# EAGLE design Tractive System Board Rev1 (EAGLE 9.6.2)

## Sheet 1 of 3
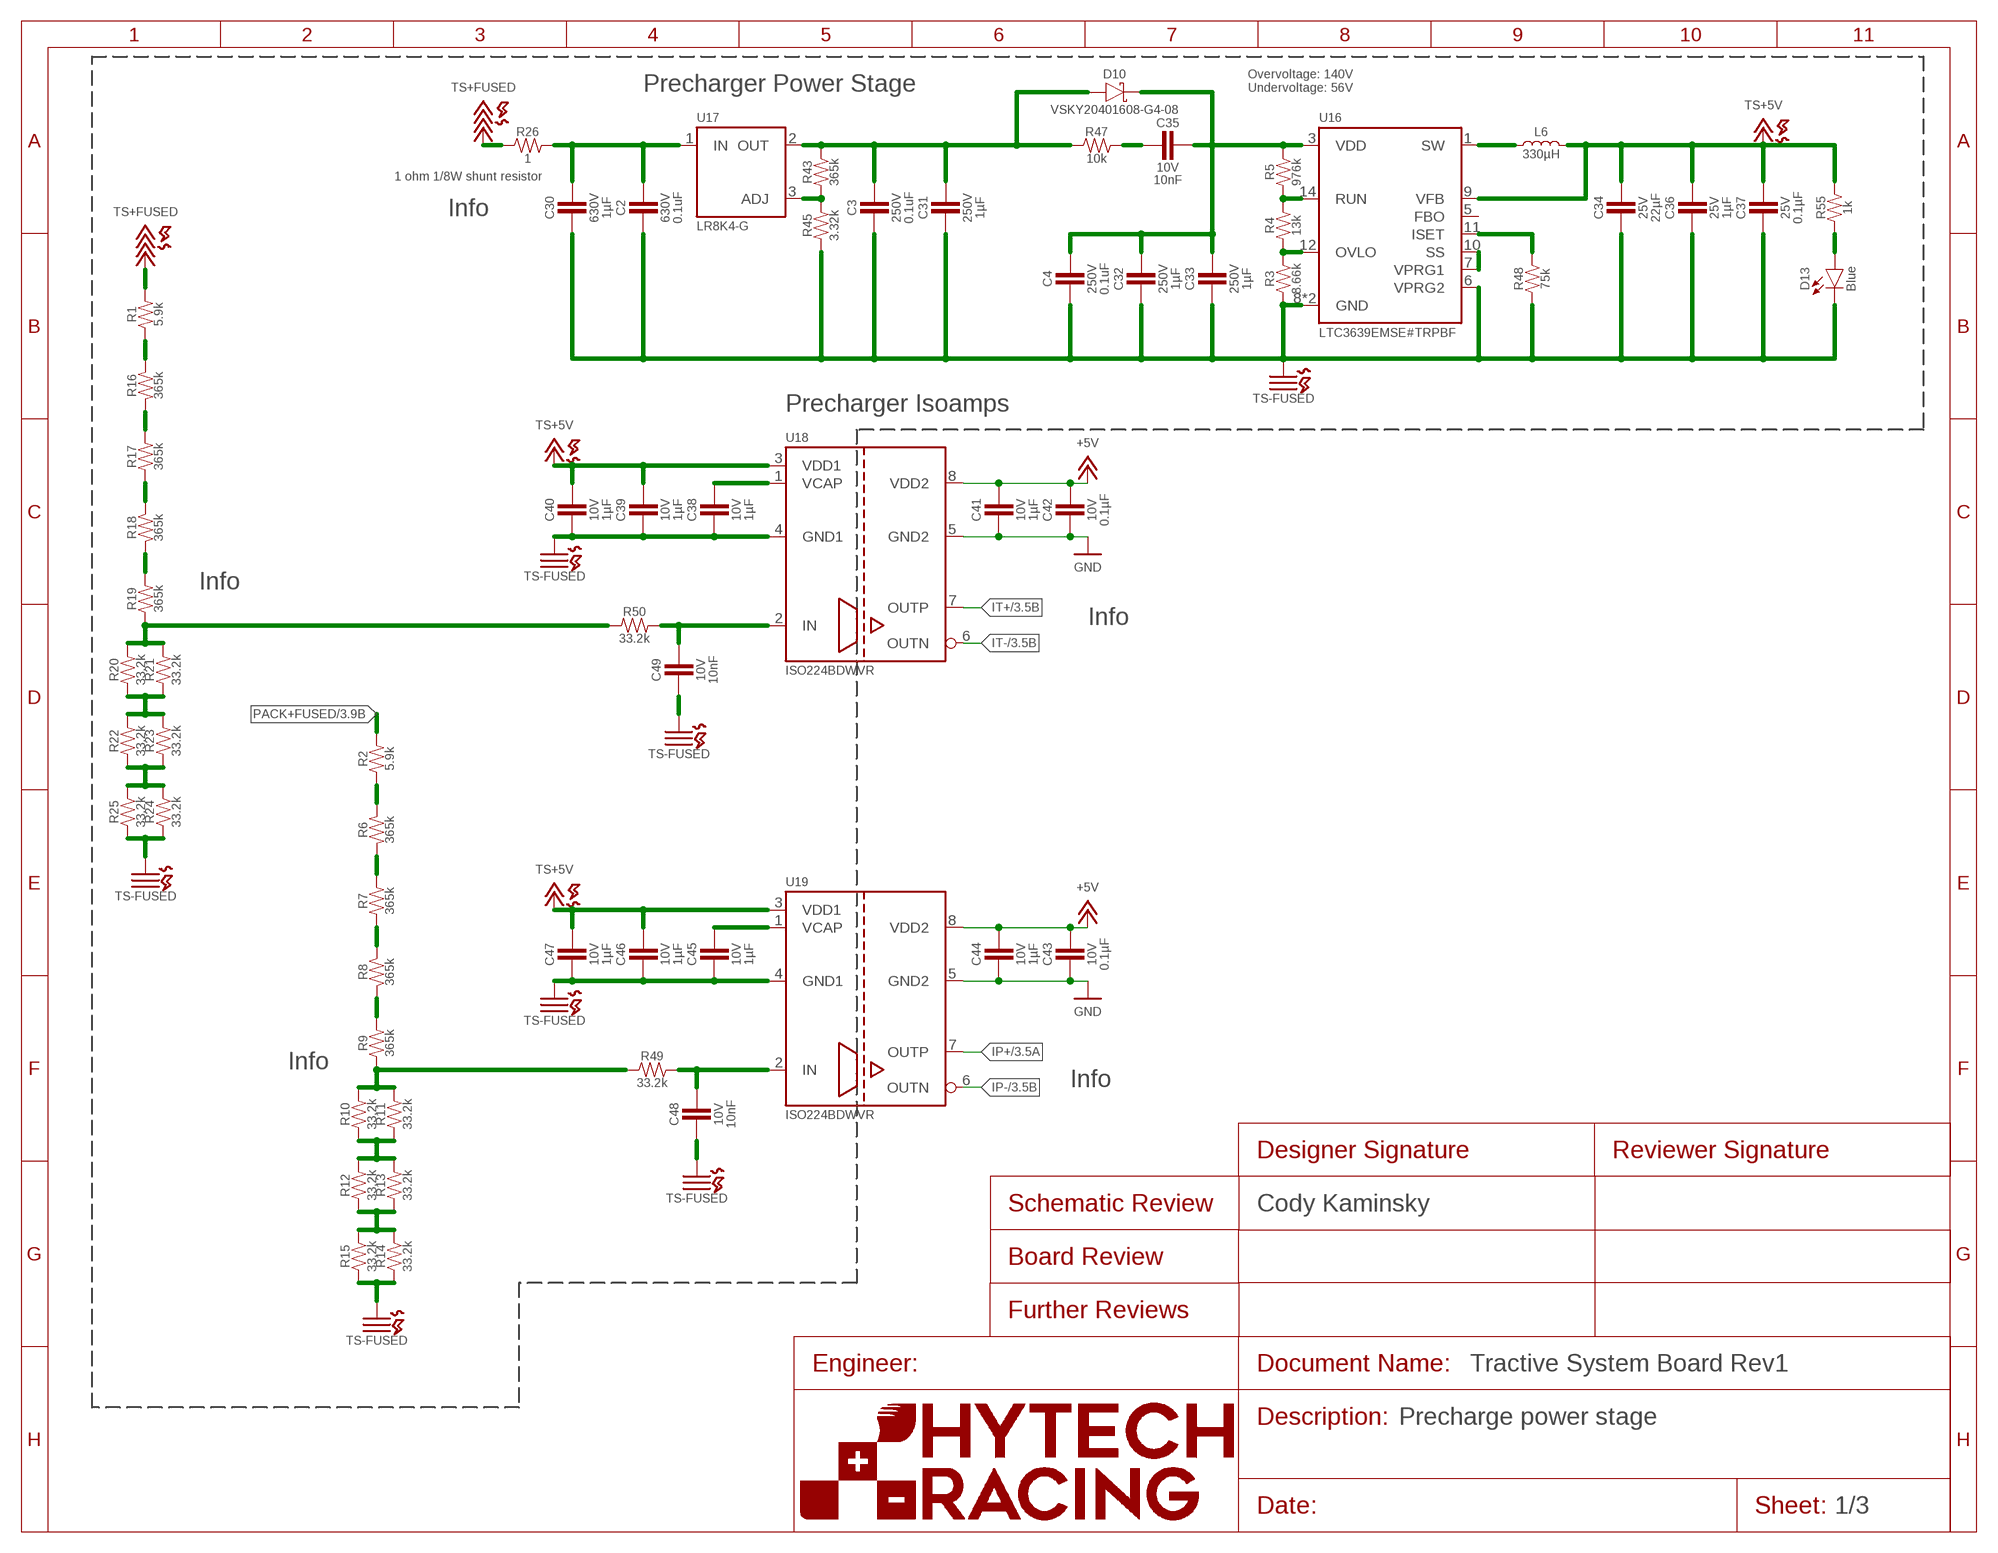
[diagram p0: schematic, sheet 1]
FRAME5 (FRAME): DESCRIPTION_1: Precharge power stage; DESIGNER_SCHEMATIC: Cody Kaminsky

### Parts
C2  CAPACITOR_2220_630V_0.1UF  [2220-CAP]
C3  CAPACITOR_1206_250V_0.1UF  [1206-CAP]
C4  CAPACITOR_1206_250V_0.1UF  [1206-CAP]
C30  CAPACITOR_2220_630V_1UF  [2220-CAP]
C31  CAPACITOR_2220_250V_1UF  [2220-CAP]
C32  CAPACITOR_2220_250V_1UF  [2220-CAP]
C33  CAPACITOR_2220_250V_1UF  [2220-CAP]
C34  CAPACITOR_0805_25V_22UF  [0805-CAP]
C35  CAPACITOR_0603_10V_10NF  [0603-CAP]
C36  CAPACITOR_0603_25V_1UF  [0603-CAP]
C37  CAPACITOR_0603_25V_0.1UF  [0603-CAP]
C38  CAPACITOR_0603_10V_1UF  [0603-CAP]
C39  CAPACITOR_0603_10V_1UF  [0603-CAP]
C40  CAPACITOR_0603_10V_1UF  [0603-CAP]
C41  CAPACITOR_0603_10V_1UF  [0603-CAP]
C42  CAPACITOR_0603_10V_0.1UF  [0603-CAP]
C43  CAPACITOR_0603_10V_0.1UF  [0603-CAP]
C44  CAPACITOR_0603_10V_1UF  [0603-CAP]
C45  CAPACITOR_0603_10V_1UF  [0603-CAP]
C46  CAPACITOR_0603_10V_1UF  [0603-CAP]
C47  CAPACITOR_0603_10V_1UF  [0603-CAP]
C48  CAPACITOR_0603_10V_10NF  [0603-CAP]
C49  CAPACITOR_0603_10V_10NF  [0603-CAP]
D10  SCHOTTKY  [CLP1608-2L]
D13  LED_0603_BLUE  [0603-LED]
L6  INDUCTOR_SRU1048_330UH  [SRU1048]
R1  RESISTOR_0603_5.9K  [0603-RES]
R2  RESISTOR_0603_5.9K  [0603-RES]
R3  RESISTOR_0603_8.66K  [0603-RES]
R4  RESISTOR_0603_13K  [0603-RES]
R5  RESISTOR_0805_976K  [0805-RES]
R6  RESISTOR_0805_365K  [0805-RES]
R7  RESISTOR_0805_365K  [0805-RES]
R8  RESISTOR_0805_365K  [0805-RES]
R9  RESISTOR_0805_365K  [0805-RES]
R10  RESISTOR_0603_33.2K  [0603-RES]
R11  RESISTOR_0603_33.2K  [0603-RES]
R12  RESISTOR_0603_33.2K  [0603-RES]
R13  RESISTOR_0603_33.2K  [0603-RES]
R14  RESISTOR_0603_33.2K  [0603-RES]
R15  RESISTOR_0603_33.2K  [0603-RES]
R16  RESISTOR_0805_365K  [0805-RES]
R17  RESISTOR_0805_365K  [0805-RES]
R18  RESISTOR_0805_365K  [0805-RES]
R19  RESISTOR_0805_365K  [0805-RES]
R20  RESISTOR_0603_33.2K  [0603-RES]
R21  RESISTOR_0603_33.2K  [0603-RES]
R22  RESISTOR_0603_33.2K  [0603-RES]
R23  RESISTOR_0603_33.2K  [0603-RES]
R24  RESISTOR_0603_33.2K  [0603-RES]
R25  RESISTOR_0603_33.2K  [0603-RES]
R26  RESISTOR_0805_1  [0805-RES]
R43  RESISTOR_0805_365K  [0805-RES]
R45  RESISTOR_0603_3.32K  [0603-RES]
R47  RESISTOR_0603_10K  [0603-RES]
R48  RESISTOR_0603_75K  [0603-RES]
R49  RESISTOR_0603_33.2K  [0603-RES]
R50  RESISTOR_0603_33.2K  [0603-RES]
R55  RESISTOR_0603_1K  [0603-RES]
U16  LTC3639  [MSE16(12)]
U17  VOLTAGE_REGULATOR_ADJ_LR8_DPAK  [DPAK(2-7K1S)]
U18  ISO224B_AIRGAP  [SOIC-08(WIDE,0.295")-AIRGAP]
U19  ISO224B_AIRGAP  [SOIC-08(WIDE,0.295")-AIRGAP]

### Nets
+5V: C41.1 C42.1 C43.1 C44.1 U18.8(VDD2) U19.8(VDD2) ; also sheet 2,3
GND: C41.2 C42.2 C43.2 C44.2 U18.5(GND2) U19.5(GND2) ; also sheet 2,3
IP+: U19.7(OUTP) ; also sheet 3
IP-: U19.6(OUTN) ; also sheet 3
IT+: U18.7(OUTP) ; also sheet 3
IT-: U18.6(OUTN) ; also sheet 3
N$2: R3.2 R4.1 U16.12(OVLO)
N$5: R4.2 R5.1 U16.14(RUN)
N$7: R6.2 R7.2
N$8: R7.1 R8.1
N$9: R1.1 R16.1
N$10: R2.1 R6.1
N$11: R8.2 R9.2
N$12: R20.1 R21.1 R22.2 R23.2
N$13: R9.1 R10.2 R11.2 R49.1
N$15: C2.1 C30.1 R26.2 U17.1(IN)
N$19: R16.2 R17.2
N$20: R17.1 R18.1
N$21: R18.2 R19.2
N$23: R19.1 R20.2 R21.2 R50.1
N$32: R12.1 R13.1 R14.2 R15.2
N$33: R22.1 R23.1 R24.2 R25.2
N$34: R10.1 R11.1 R12.2 R13.2
N$35: D13.2(A) R55.1
N$54: R43.1 R45.2 U17.3(ADJ)
N$58: C3.1 C31.1 D10.2(A) R43.2 R47.1 U17.2(OUT)
N$60: C35.2 R47.2
N$61: C4.1 C32.1 C33.1 C35.1 D10.1(C) R5.2 U16.3(VDD)
N$62: C48.1 R49.2 U19.2(IN)
N$63: C49.1 R50.2 U18.2(IN)
N$64: R48.2 U16.11(ISET)
N$65: L6.1 U16.1(SW)
N$69: C45.1 U19.1(VCAP)
N$73: C38.1 U18.1(VCAP)
N$76: U16.7(VPRG1) U16.10(SS)
PACK+FUSED: R2.2 ; also sheet 3
TS+5V: C34.1 C36.1 C37.1 C39.1 C40.1 C46.1 C47.1 L6.2 R55.2 U16.9(VFB) U18.3(VDD1) U19.3(VDD1) ; also sheet 3
TS+FUSED: R1.2 R26.1 ; also sheet 2,3
TS-FUSED: C2.2 C3.2 C4.2 C30.2 C31.2 C32.2 C33.2 C34.2 C36.2 C37.2 C38.2 C39.2 C40.2 C45.2 C46.2 C47.2 C48.2 C49.2 D13.1(C) R3.1 R14.1 R15.1 R24.1 R25.1 R45.1 R48.1 U16.6(VPRG2) U16.8(GND) U16.16(GND) U18.4(GND1) U19.4(GND1) ; also sheet 2,3
Unconnected: U16.5(FBO)

### Notes on the sheet
- Precharger Power Stage
- Overvoltage: 140V
  Undervoltage: 56V
- 1 ohm 1/8W shunt resistor
- Info
- Precharger Isoamps
- Info
- Info
- Info
- Info

## Sheet 2 of 3
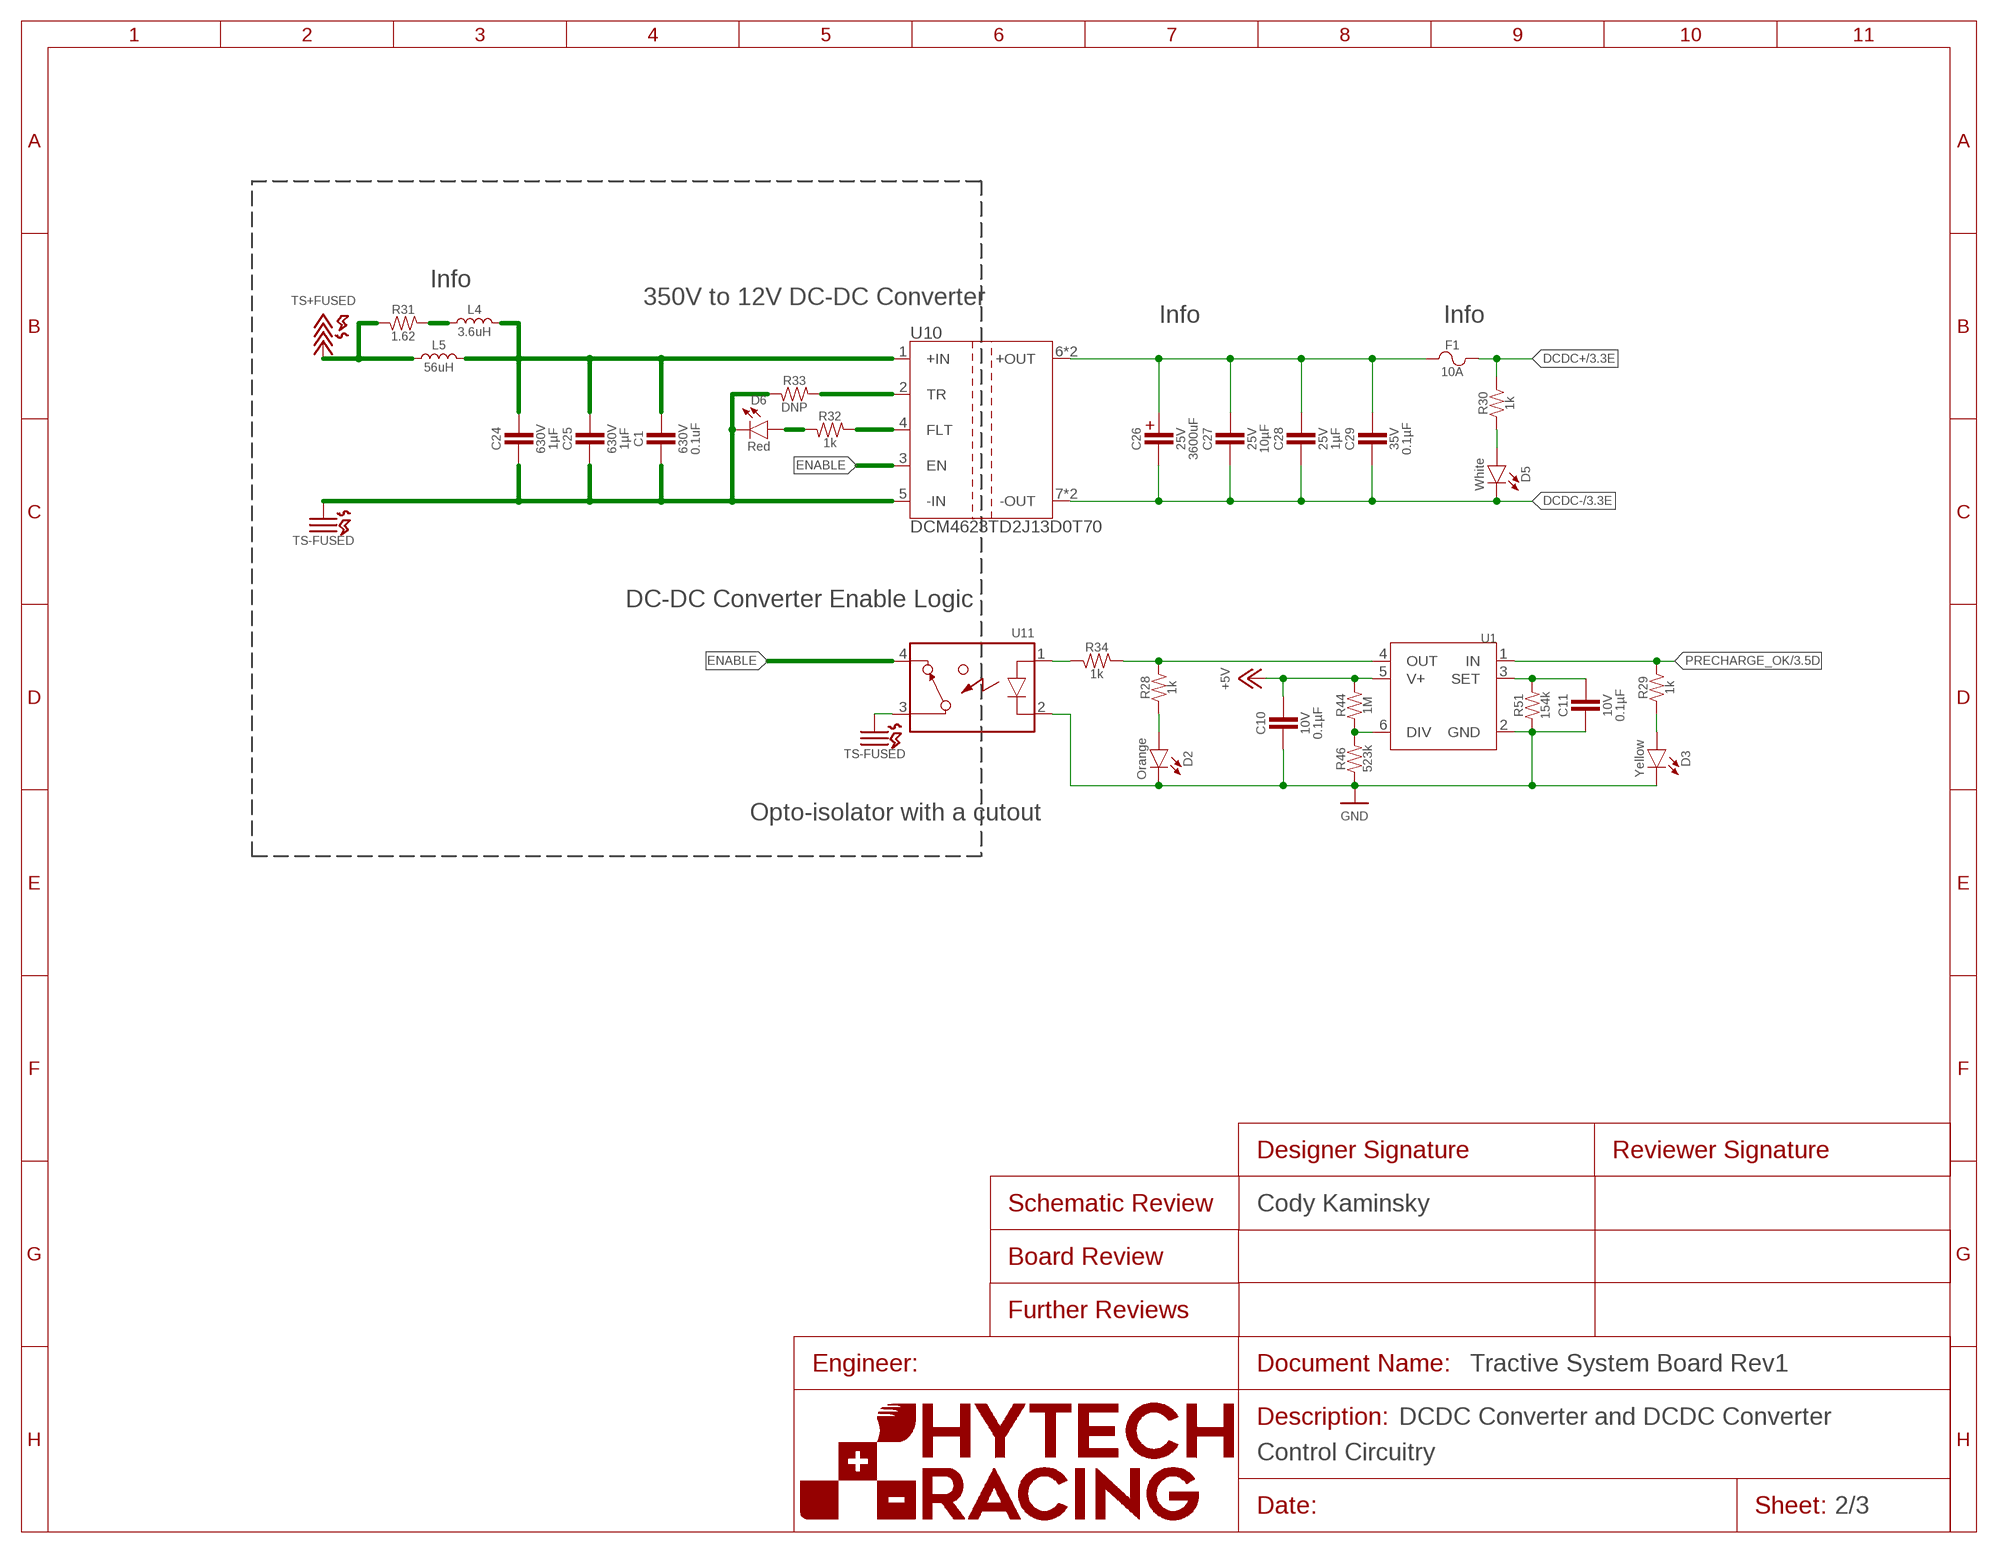
[diagram p1: schematic, sheet 2]
FRAME3 (FRAME): DESCRIPTION_1: DCDC Converter and DCDC Converter; DESCRIPTION_2: Control Circuitry; DESIGNER_SCHEMATIC: Cody Kaminsky

### Parts
C1  CAPACITOR_2220_630V_0.1UF  [2220-CAP]
C10  CAPACITOR_0603_10V_0.1UF  [0603-CAP]
C11  CAPACITOR_0603_10V_0.1UF  [0603-CAP]
C24  CAPACITOR_2220_630V_1UF  [2220-CAP]
C25  CAPACITOR_2220_630V_1UF  [2220-CAP]
C26  CAPACITOR_POLAR__3600UF  [EKYC*MM]
C27  CAPACITOR_0603_25V_10UF  [0603-CAP]
C28  CAPACITOR_0603_25V_1UF  [0603-CAP]
C29  CAPACITOR_0603_35V_0.1UF  [0603-CAP]
D2  LED_0603_ORANGE  [0603-LED]
D3  LED_0603_YELLOW  [0603-LED]
D5  LED_0603_WHITE  [0603-LED]
D6  LED_0603_RED  [0603-LED]
F1  FUSE_MB_10  [MINI-BLADE_FUSE_HOLDER]
L4  INDUCTOR_PA4334_3.6UH  [PA4334]
L5  INDUCTOR_WELMHI_56UH  [WE-LMHI]
R28  RESISTOR_0603_1K  [0603-RES]
R29  RESISTOR_0603_1K  [0603-RES]
R30  RESISTOR_0603_1K  [0603-RES]
R31  RESISTOR_0603_1.62  [0603-RES]
R32  RESISTOR_0603_1K  [0603-RES]
R33  RESISTOR_0603_DNP  [0603-RES]
R34  RESISTOR_0603_1K  [0603-RES]
R44  RESISTOR_0805_1M  [0805-RES]
R46  RESISTOR_0805_523K  [0805-RES]
R51  RESISTOR_0603_154K  [0603-RES]
U1  LTC6994_1  [SOT-23-6]
U10  DCM4623TD2J13D0T70  [DCM4623]
U11  RELAY_SOLIDSTATE_NC_AG  [DIP-4_AIRGAP]

### Nets
+5V: C10.1 R44.2 U1.5(V+) ; also sheet 1,3
DCDC+: F1.L1 F1.L2 R30.2 ; also sheet 3
DCDC-: C26.-(MINUS) C27.1 C28.1 C29.1 D5.1(C) U10.7(-OUT) U10.9(-OUT) ; also sheet 3
ENABLE: U10.3(EN) U11.4(CONTACT2)
GND: C10.2 C11.2 D2.1(C) D3.1(C) R46.1 R51.1 U1.2(GND) U11.2(CONTROL-) ; also sheet 1,3
N$4: R44.1 R46.2 U1.6(DIV)
N$6: R34.2 U11.1(CONTROL+)
N$14: C11.1 R51.2 U1.3(SET)
N$16: R28.2 R34.1 U1.4(OUT)
N$17: D2.2(A) R28.1
N$18: D5.2(A) R30.1
N$22: D3.2(A) R29.1
N$29: L4.2 R31.1
N$39: C1.1 C24.1 C25.1 L4.1 L5.1 U10.1(+IN)
N$43: D6.2(A) R32.2
N$44: R32.1 U10.4(FLT)
N$45: R33.1 U10.2(TR)
N$46: C26.+(PLUS) C27.2 C28.2 C29.2 F1.R1 F1.R2 U10.6(+OUT) U10.8(+OUT)
PRECHARGE_OK: R29.2 U1.1(IN) ; also sheet 3
TS+FUSED: L5.2 R31.2 ; also sheet 1,3
TS-FUSED: C1.2 C24.2 C25.2 D6.1(C) R33.2 U10.5(-IN) U11.3(CONTACT1) ; also sheet 1,3

### Notes on the sheet
- Info
- 350V to 12V DC-DC Converter
- Info | Info
- DC-DC Converter Enable Logic
- Opto-isolator with a cutout

## Sheet 3 of 3
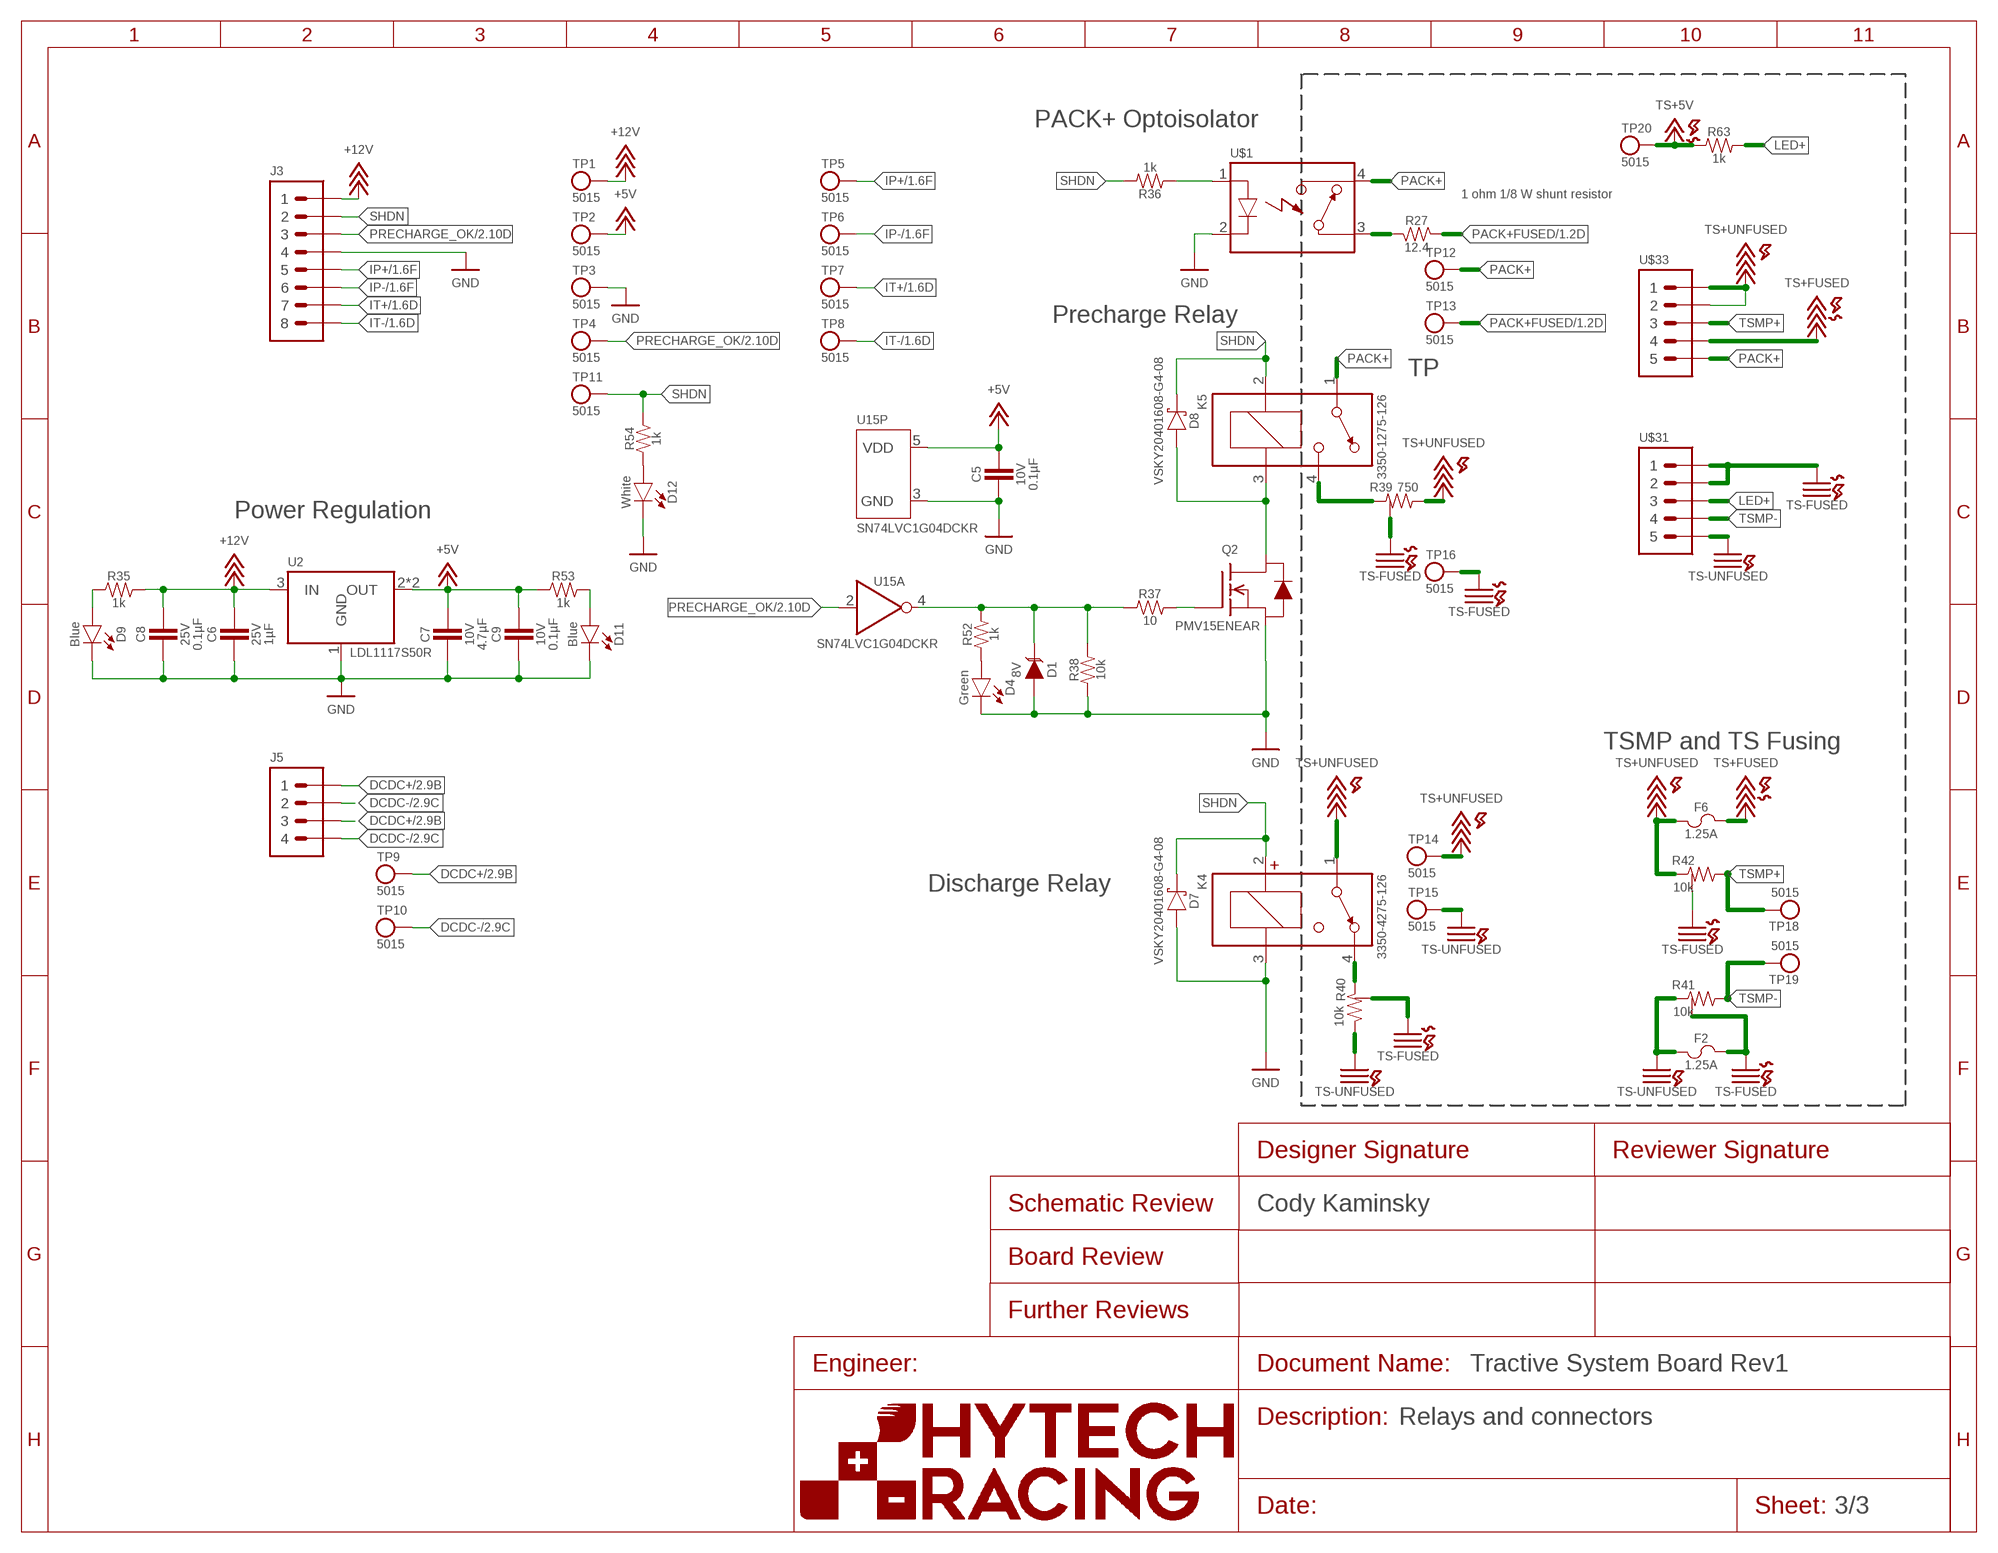
[diagram p2: schematic, sheet 3]
FRAME4 (FRAME): DESCRIPTION_1: Relays and connectors; DESIGNER_SCHEMATIC: Cody Kaminsky

### Parts
C5  CAPACITOR_0603_10V_0.1UF  [0603-CAP]
C6  CAPACITOR_0603_25V_1UF  [0603-CAP]
C7  CAPACITOR_0603_10V_4.7UF  [0603-CAP]
C8  CAPACITOR_0603_25V_0.1UF  [0603-CAP]
C9  CAPACITOR_0603_10V_0.1UF  [0603-CAP]
D1  TVS_8V  [SOT-23]
D4  LED_0603_GREEN  [0603-LED]
D7  SCHOTTKY  [CLP1608-2L]
D8  SCHOTTKY  [CLP1608-2L]
D9  LED_0603_BLUE  [0603-LED]
D11  LED_0603_BLUE  [0603-LED]
D12  LED_0603_WHITE  [0603-LED]
F2  FUSE_0885_1.25  [0885]
F6  FUSE_0885_1.25  [0885]
J3  CONNECTOR-8_MF_T_V_  [MOLEX_MICROFIT_PTH_VERTICAL_08_DUAL]
J5  CONNECTOR-4__  [MOLEX_MICROFIT_PTH_VERTICAL_04_DUAL]
K4  RELAY_SPST_NC_POLARIZED_3550_12  [335X]
K5  RELAY_SPST_NO_3550_12  [335X]
Q2  TRANSISTOR_N_MOS__PMV15ENEA  [SOT-23]
R27  RESISTOR_0805_12.4  [0805-RES]
R35  RESISTOR_0603_1K  [0603-RES]
R36  RESISTOR_0603_1K  [0603-RES]
R37  RESISTOR_0603_10  [0603-RES]
R38  RESISTOR_0603_10K  [0603-RES]
R39  RESISTOR_GND_750  [B20]
R40  RESISTOR_GND_10K  [B20]
R41  RESISTOR_GND_10K  [B20]
R42  RESISTOR_GND_10K  [B20]
R52  RESISTOR_0603_1K  [0603-RES]
R53  RESISTOR_0603_1K  [0603-RES]
R54  RESISTOR_0603_1K  [0603-RES]
R63  RESISTOR_0603_1K  [0603-RES]
TP1  TEST_POINT  [MICRO_MINIATURE]
TP2  TEST_POINT  [MICRO_MINIATURE]
TP3  TEST_POINT  [MICRO_MINIATURE]
TP4  TEST_POINT  [MICRO_MINIATURE]
TP5  TEST_POINT  [MICRO_MINIATURE]
TP6  TEST_POINT  [MICRO_MINIATURE]
TP7  TEST_POINT  [MICRO_MINIATURE]
TP8  TEST_POINT  [MICRO_MINIATURE]
TP9  TEST_POINT  [MICRO_MINIATURE]
TP10  TEST_POINT  [MICRO_MINIATURE]
TP11  TEST_POINT  [MICRO_MINIATURE]
TP12  TEST_POINT  [MICRO_MINIATURE]
TP13  TEST_POINT  [MICRO_MINIATURE]
TP14  TEST_POINT  [MICRO_MINIATURE]
TP15  TEST_POINT  [MICRO_MINIATURE]
TP16  TEST_POINT  [MICRO_MINIATURE]
TP18  TEST_POINT  [MICRO_MINIATURE]
TP19  TEST_POINT  [MICRO_MINIATURE]
TP20  TEST_POINT  [MICRO_MINIATURE]
U2  VOLTAGE_REGULATOR_SOT223_5V  [SOT223]
U15  LOGICGATE_INVERTER_DCKR  [SC-70-5]
U$1  RELAY_SOLIDSTATE_NO_AG  [DIP-4_AIRGAP]
U$31  CONNECTOR-5_MICRO_V6S_  [MOLEX_MICROFIT_PTH_VERTICAL_06_SINGLE_SPACED]
U$33  CONNECTOR-5_MICRO_V7S_  [MOLEX_MICROFIT_PTH_VERTICAL_07_SINGLE_SPACED]

### Nets
+5V: C5.1 C7.1 C9.1 R53.1 TP2.1 U2.2(OUT) U2.4(OUT) U15.5(P:VDD) ; also sheet 1,2
+12V: C6.1 C8.1 J3.1 R35.2 TP1.1 U2.3(IN)
DCDC+: J5.1 J5.3 TP9.1 ; also sheet 2
DCDC-: J5.2 J5.4 TP10.1 ; also sheet 2
GND: C5.2 C6.2 C7.2 C8.2 C9.2 D1.1(A) D4.1(C) D7.2(A) D9.1(C) D11.1(C) D12.1(C) J3.4 K4.3(COIL-) Q2.2(S) R38.1 TP3.1 U2.1(GND) U15.3(P:GND) U$1.2(CONTROL-) ; also sheet 1,2
IP+: J3.5 TP5.1 ; also sheet 1
IP-: J3.6 TP6.1 ; also sheet 1
IT+: J3.7 TP7.1 ; also sheet 1
IT-: J3.8 TP8.1 ; also sheet 1
LED+: R63.2 U$31.3
N$3: Q2.1(G) R37.2
N$24: D4.2(A) R52.1
N$25: D9.2(A) R35.1
N$30: D11.2(A) R53.2
N$31: D12.2(A) R54.1
N$40: D8.2(A) K5.3(COIL-) Q2.3(D)
N$50: K5.4(CONTACT2) R39.1
N$51: K4.4(CONTACT2) R40.1
N$52: D1.3(C) R37.1 R38.2 R52.2 U15.4(A:!IN)
N$53: R36.1 U$1.1(CONTROL+)
N$57: R27.2 U$1.3(CONTACT1)
PACK+: K5.1(CONTACT1) TP12.1 U$1.4(CONTACT2) U$33.5
PACK+FUSED: R27.1 TP13.1 ; also sheet 1
PRECHARGE_OK: J3.3 TP4.1 U15.2(A:IN) ; also sheet 2
SHDN: D7.1(C) D8.1(C) J3.2 K4.2(COIL+) K5.2(COIL+) R36.2 R54.2 TP11.1
TS+5V: R63.1 TP20.1 ; also sheet 1
TS+FUSED: F6.2 U$33.4 ; also sheet 1,2
TS+UNFUSED: F6.1 K4.1(CONTACT1) R39.2 R42.1 TP14.1 U$33.1 U$33.2
TS-FUSED: F2.2 R39.3 R39.4 R39.5 R39.6 R40.3 R40.4 R40.5 R40.6 R41.3 R41.4 R41.5 R41.6 R42.3 R42.4 R42.5 R42.6 TP16.1 U$31.1 U$31.2 ; also sheet 1,2
TS-UNFUSED: F2.1 R40.2 R41.1 TP15.1 U$31.5
TSMP+: R42.2 TP18.1 U$33.3
TSMP-: R41.2 TP19.1 U$31.4

### Notes on the sheet
- PACK+ Optoisolator
- 1 ohm 1/8 W shunt resistor
- Precharge Relay
- TP
- Power Regulation
- TSMP and TS Fusing
- Discharge Relay

## Library data of the parts
C1 C2 = HyTechDevices:CAPACITOR_?_*: Capacitor, Non-Polarized VJ...1BC Series Datasheet <https://www.mouser.com/datasheet/2/427/vjw1bcbascomseries-1762447.pdf> Samsung Datasheet <https://www.mouser.com/datasheet/2/585/MLCC-1837944.pdf> Walsin Datasheet <https://www.mouser.com/datasheet/2/210/WTC_MLCC_General_Purpose-1534899.pdf> GRM188R61A226ME15D <https://www.mouser.com/datasheet/2/281/1/GRM188R61A226ME15_02A-1985787.pdf> GRM188R61E106MA73D <https://www.mouser.com/datasheet/2/281/1/GRM188R61E106MA73_01A-1985806.pdf> 885012006013 <https://www.mouser.com/datasheet/2/445/885012006013-1726946.pdf> 2220Y6300105KXTWS2 <https://www.mouser.com/datasheet/2/218/SMD_High_and_Std_StackiCap_P62-1825512.pdf> Yageo Class 2, X5R <https://www.mouser.com/datasheet/2/447/UPY_GPHC_X5R_4V_to_50V_26-1827097.pdf> TDK C Series <https://www.mouser.com/ProductDetail/TDK/C3216X5R1V226M160AC?qs=%2Fha2pyFadujbcx9jh7lYl%2F4NeMoXFhdc8AqVWNq4wW6M2y7zl6GzBuhgtI0ngznN> AVX Automotive MLCC <https://www.mouser.com/datasheet/2/40/AutoMLCC-777028.pdf> KEMET X7R Series <https://www.mouser.com/datasheet/2/212/KEM_C1002_X7R_SMD-1102033.pdf>; CAPACITANCE: 0.1uF; DKPN: 445-11980-2-ND; MANUFACTURER: TDK Coporation; MOPN: 810-C5750CH2J104K2KC; MPN: C5750CH2J104K280KC; TOLERANCE: 10%; VOLTAGE: 630V
C3 C4 = HyTechDevices:CAPACITOR_?_*: Capacitor, Non-Polarized VJ...1BC Series Datasheet <https://www.mouser.com/datasheet/2/427/vjw1bcbascomseries-1762447.pdf> Samsung Datasheet <https://www.mouser.com/datasheet/2/585/MLCC-1837944.pdf> Walsin Datasheet <https://www.mouser.com/datasheet/2/210/WTC_MLCC_General_Purpose-1534899.pdf> GRM188R61A226ME15D <https://www.mouser.com/datasheet/2/281/1/GRM188R61A226ME15_02A-1985787.pdf> GRM188R61E106MA73D <https://www.mouser.com/datasheet/2/281/1/GRM188R61E106MA73_01A-1985806.pdf> 885012006013 <https://www.mouser.com/datasheet/2/445/885012006013-1726946.pdf> 2220Y6300105KXTWS2 <https://www.mouser.com/datasheet/2/218/SMD_High_and_Std_StackiCap_P62-1825512.pdf> Yageo Class 2, X5R <https://www.mouser.com/datasheet/2/447/UPY_GPHC_X5R_4V_to_50V_26-1827097.pdf> TDK C Series <https://www.mouser.com/ProductDetail/TDK/C3216X5R1V226M160AC?qs=%2Fha2pyFadujbcx9jh7lYl%2F4NeMoXFhdc8AqVWNq4wW6M2y7zl6GzBuhgtI0ngznN> AVX Automotive MLCC <https://www.mouser.com/datasheet/2/40/AutoMLCC-777028.pdf> KEMET X7R Series <https://www.mouser.com/datasheet/2/212/KEM_C1002_X7R_SMD-1102033.pdf>; CAPACITANCE: 0.1uF; DKPN: 445-6079-2-ND; MANUFACTURER: TDK Corporation; MOPN: 810-C3216X7R2E104KT5; MPN: C3216X7R2E104K160AM; TOLERANCE: 10%; VOLTAGE: 250V
C5 C9-C11 C42 C43 = HyTechDevices:CAPACITOR_?_*: Capacitor, Non-Polarized VJ...1BC Series Datasheet <https://www.mouser.com/datasheet/2/427/vjw1bcbascomseries-1762447.pdf> Samsung Datasheet <https://www.mouser.com/datasheet/2/585/MLCC-1837944.pdf> Walsin Datasheet <https://www.mouser.com/datasheet/2/210/WTC_MLCC_General_Purpose-1534899.pdf> GRM188R61A226ME15D <https://www.mouser.com/datasheet/2/281/1/GRM188R61A226ME15_02A-1985787.pdf> GRM188R61E106MA73D <https://www.mouser.com/datasheet/2/281/1/GRM188R61E106MA73_01A-1985806.pdf> 885012006013 <https://www.mouser.com/datasheet/2/445/885012006013-1726946.pdf> 2220Y6300105KXTWS2 <https://www.mouser.com/datasheet/2/218/SMD_High_and_Std_StackiCap_P62-1825512.pdf> Yageo Class 2, X5R <https://www.mouser.com/datasheet/2/447/UPY_GPHC_X5R_4V_to_50V_26-1827097.pdf> TDK C Series <https://www.mouser.com/ProductDetail/TDK/C3216X5R1V226M160AC?qs=%2Fha2pyFadujbcx9jh7lYl%2F4NeMoXFhdc8AqVWNq4wW6M2y7zl6GzBuhgtI0ngznN> AVX Automotive MLCC <https://www.mouser.com/datasheet/2/40/AutoMLCC-777028.pdf> KEMET X7R Series <https://www.mouser.com/datasheet/2/212/KEM_C1002_X7R_SMD-1102033.pdf>; CAPACITANCE: 0.1µF; DKPN: 720-1688-1-ND; MANUFACTURER: Vishay Vitramon; MOPN: 77-VJ0603Y104JXQPBC; MPN: VJ0603Y104JXQPW1BC; TOLERANCE: 5%; VOLTAGE: 10V
C6 C28 C36 = HyTechDevices:CAPACITOR_?_*: Capacitor, Non-Polarized VJ...1BC Series Datasheet <https://www.mouser.com/datasheet/2/427/vjw1bcbascomseries-1762447.pdf> Samsung Datasheet <https://www.mouser.com/datasheet/2/585/MLCC-1837944.pdf> Walsin Datasheet <https://www.mouser.com/datasheet/2/210/WTC_MLCC_General_Purpose-1534899.pdf> GRM188R61A226ME15D <https://www.mouser.com/datasheet/2/281/1/GRM188R61A226ME15_02A-1985787.pdf> GRM188R61E106MA73D <https://www.mouser.com/datasheet/2/281/1/GRM188R61E106MA73_01A-1985806.pdf> 885012006013 <https://www.mouser.com/datasheet/2/445/885012006013-1726946.pdf> 2220Y6300105KXTWS2 <https://www.mouser.com/datasheet/2/218/SMD_High_and_Std_StackiCap_P62-1825512.pdf> Yageo Class 2, X5R <https://www.mouser.com/datasheet/2/447/UPY_GPHC_X5R_4V_to_50V_26-1827097.pdf> TDK C Series <https://www.mouser.com/ProductDetail/TDK/C3216X5R1V226M160AC?qs=%2Fha2pyFadujbcx9jh7lYl%2F4NeMoXFhdc8AqVWNq4wW6M2y7zl6GzBuhgtI0ngznN> AVX Automotive MLCC <https://www.mouser.com/datasheet/2/40/AutoMLCC-777028.pdf> KEMET X7R Series <https://www.mouser.com/datasheet/2/212/KEM_C1002_X7R_SMD-1102033.pdf>; CAPACITANCE: 1µF; DKPN: 1276-1184-1-ND; MANUFACTURER: Samsung Electro-Mechanics; MOPN: 187-CL10B105KA8NNNC; MPN: CL10B105KA8NNNC; TOLERANCE: 10%; VOLTAGE: 25V
C7 = HyTechDevices:CAPACITOR_?_*: Capacitor, Non-Polarized VJ...1BC Series Datasheet <https://www.mouser.com/datasheet/2/427/vjw1bcbascomseries-1762447.pdf> Samsung Datasheet <https://www.mouser.com/datasheet/2/585/MLCC-1837944.pdf> Walsin Datasheet <https://www.mouser.com/datasheet/2/210/WTC_MLCC_General_Purpose-1534899.pdf> GRM188R61A226ME15D <https://www.mouser.com/datasheet/2/281/1/GRM188R61A226ME15_02A-1985787.pdf> GRM188R61E106MA73D <https://www.mouser.com/datasheet/2/281/1/GRM188R61E106MA73_01A-1985806.pdf> 885012006013 <https://www.mouser.com/datasheet/2/445/885012006013-1726946.pdf> 2220Y6300105KXTWS2 <https://www.mouser.com/datasheet/2/218/SMD_High_and_Std_StackiCap_P62-1825512.pdf> Yageo Class 2, X5R <https://www.mouser.com/datasheet/2/447/UPY_GPHC_X5R_4V_to_50V_26-1827097.pdf> TDK C Series <https://www.mouser.com/ProductDetail/TDK/C3216X5R1V226M160AC?qs=%2Fha2pyFadujbcx9jh7lYl%2F4NeMoXFhdc8AqVWNq4wW6M2y7zl6GzBuhgtI0ngznN> AVX Automotive MLCC <https://www.mouser.com/datasheet/2/40/AutoMLCC-777028.pdf> KEMET X7R Series <https://www.mouser.com/datasheet/2/212/KEM_C1002_X7R_SMD-1102033.pdf>; CAPACITANCE: 4.7µF; DKPN: 1276-1044-1-ND; MANUFACTURER: Samsung Electro-Mechanics; MOPN: 187-CL10A475KP8NNNC; MPN: CL10A475KP8NNNC; TOLERANCE: 10%; VOLTAGE: 10V
C8 C37 = HyTechDevices:CAPACITOR_?_*: Capacitor, Non-Polarized VJ...1BC Series Datasheet <https://www.mouser.com/datasheet/2/427/vjw1bcbascomseries-1762447.pdf> Samsung Datasheet <https://www.mouser.com/datasheet/2/585/MLCC-1837944.pdf> Walsin Datasheet <https://www.mouser.com/datasheet/2/210/WTC_MLCC_General_Purpose-1534899.pdf> GRM188R61A226ME15D <https://www.mouser.com/datasheet/2/281/1/GRM188R61A226ME15_02A-1985787.pdf> GRM188R61E106MA73D <https://www.mouser.com/datasheet/2/281/1/GRM188R61E106MA73_01A-1985806.pdf> 885012006013 <https://www.mouser.com/datasheet/2/445/885012006013-1726946.pdf> 2220Y6300105KXTWS2 <https://www.mouser.com/datasheet/2/218/SMD_High_and_Std_StackiCap_P62-1825512.pdf> Yageo Class 2, X5R <https://www.mouser.com/datasheet/2/447/UPY_GPHC_X5R_4V_to_50V_26-1827097.pdf> TDK C Series <https://www.mouser.com/ProductDetail/TDK/C3216X5R1V226M160AC?qs=%2Fha2pyFadujbcx9jh7lYl%2F4NeMoXFhdc8AqVWNq4wW6M2y7zl6GzBuhgtI0ngznN> AVX Automotive MLCC <https://www.mouser.com/datasheet/2/40/AutoMLCC-777028.pdf> KEMET X7R Series <https://www.mouser.com/datasheet/2/212/KEM_C1002_X7R_SMD-1102033.pdf>; CAPACITANCE: 0.1µF; DKPN: 1276-1006-1-ND; MANUFACTURER: Samsung Electro-Mechanics; MOPN: 187-CL10B104KA8NNNC; MPN: CL10B104KA8NNNC; TOLERANCE: 10%; VOLTAGE: 25V
C24 C25 C30 = HyTechDevices:CAPACITOR_?_*: Capacitor, Non-Polarized VJ...1BC Series Datasheet <https://www.mouser.com/datasheet/2/427/vjw1bcbascomseries-1762447.pdf> Samsung Datasheet <https://www.mouser.com/datasheet/2/585/MLCC-1837944.pdf> Walsin Datasheet <https://www.mouser.com/datasheet/2/210/WTC_MLCC_General_Purpose-1534899.pdf> GRM188R61A226ME15D <https://www.mouser.com/datasheet/2/281/1/GRM188R61A226ME15_02A-1985787.pdf> GRM188R61E106MA73D <https://www.mouser.com/datasheet/2/281/1/GRM188R61E106MA73_01A-1985806.pdf> 885012006013 <https://www.mouser.com/datasheet/2/445/885012006013-1726946.pdf> 2220Y6300105KXTWS2 <https://www.mouser.com/datasheet/2/218/SMD_High_and_Std_StackiCap_P62-1825512.pdf> Yageo Class 2, X5R <https://www.mouser.com/datasheet/2/447/UPY_GPHC_X5R_4V_to_50V_26-1827097.pdf> TDK C Series <https://www.mouser.com/ProductDetail/TDK/C3216X5R1V226M160AC?qs=%2Fha2pyFadujbcx9jh7lYl%2F4NeMoXFhdc8AqVWNq4wW6M2y7zl6GzBuhgtI0ngznN> AVX Automotive MLCC <https://www.mouser.com/datasheet/2/40/AutoMLCC-777028.pdf> KEMET X7R Series <https://www.mouser.com/datasheet/2/212/KEM_C1002_X7R_SMD-1102033.pdf>; CAPACITANCE: 1µF; DKPN: 1608-2220Y6300105KXTWS2CT-ND; MANUFACTURER: Knowles Syfer; MOPN: 843-2220Y63105KXTWS2; MPN: 2220Y6300105KXTWS2; TOLERANCE: 10%; VOLTAGE: 630V
C26 = HyTechDevices:CAPACITOR_POLAR_?_*; CAPACITANCE: 3600uF; DKPN: 565-EKYC250ELL362ML20S-ND; MANUFACTURER: United Chemi-con; MOPN: 661-YC250ELL362ML20S; MPN: EKYC250ELL362ML20S; VOLTAGE: 25V
C27 = HyTechDevices:CAPACITOR_?_*: Capacitor, Non-Polarized VJ...1BC Series Datasheet <https://www.mouser.com/datasheet/2/427/vjw1bcbascomseries-1762447.pdf> Samsung Datasheet <https://www.mouser.com/datasheet/2/585/MLCC-1837944.pdf> Walsin Datasheet <https://www.mouser.com/datasheet/2/210/WTC_MLCC_General_Purpose-1534899.pdf> GRM188R61A226ME15D <https://www.mouser.com/datasheet/2/281/1/GRM188R61A226ME15_02A-1985787.pdf> GRM188R61E106MA73D <https://www.mouser.com/datasheet/2/281/1/GRM188R61E106MA73_01A-1985806.pdf> 885012006013 <https://www.mouser.com/datasheet/2/445/885012006013-1726946.pdf> 2220Y6300105KXTWS2 <https://www.mouser.com/datasheet/2/218/SMD_High_and_Std_StackiCap_P62-1825512.pdf> Yageo Class 2, X5R <https://www.mouser.com/datasheet/2/447/UPY_GPHC_X5R_4V_to_50V_26-1827097.pdf> TDK C Series <https://www.mouser.com/ProductDetail/TDK/C3216X5R1V226M160AC?qs=%2Fha2pyFadujbcx9jh7lYl%2F4NeMoXFhdc8AqVWNq4wW6M2y7zl6GzBuhgtI0ngznN> AVX Automotive MLCC <https://www.mouser.com/datasheet/2/40/AutoMLCC-777028.pdf> KEMET X7R Series <https://www.mouser.com/datasheet/2/212/KEM_C1002_X7R_SMD-1102033.pdf>; CAPACITANCE: 10µF; DKPN: 490-7202-1-ND; MANUFACTURER: Murata Electronics; MOPN: 81-GRM188R61E106MA3D; MPN: GRM188R61E106MA73D; TOLERANCE: 20%; VOLTAGE: 25V
C29 = HyTechDevices:CAPACITOR_?_*: Capacitor, Non-Polarized VJ...1BC Series Datasheet <https://www.mouser.com/datasheet/2/427/vjw1bcbascomseries-1762447.pdf> Samsung Datasheet <https://www.mouser.com/datasheet/2/585/MLCC-1837944.pdf> Walsin Datasheet <https://www.mouser.com/datasheet/2/210/WTC_MLCC_General_Purpose-1534899.pdf> GRM188R61A226ME15D <https://www.mouser.com/datasheet/2/281/1/GRM188R61A226ME15_02A-1985787.pdf> GRM188R61E106MA73D <https://www.mouser.com/datasheet/2/281/1/GRM188R61E106MA73_01A-1985806.pdf> 885012006013 <https://www.mouser.com/datasheet/2/445/885012006013-1726946.pdf> 2220Y6300105KXTWS2 <https://www.mouser.com/datasheet/2/218/SMD_High_and_Std_StackiCap_P62-1825512.pdf> Yageo Class 2, X5R <https://www.mouser.com/datasheet/2/447/UPY_GPHC_X5R_4V_to_50V_26-1827097.pdf> TDK C Series <https://www.mouser.com/ProductDetail/TDK/C3216X5R1V226M160AC?qs=%2Fha2pyFadujbcx9jh7lYl%2F4NeMoXFhdc8AqVWNq4wW6M2y7zl6GzBuhgtI0ngznN> AVX Automotive MLCC <https://www.mouser.com/datasheet/2/40/AutoMLCC-777028.pdf> KEMET X7R Series <https://www.mouser.com/datasheet/2/212/KEM_C1002_X7R_SMD-1102033.pdf>; CAPACITANCE: 0.1µF; DKPN: 587-3354-1-ND; MANUFACTURER: Taiyo Yuden; MOPN: 963-GMK107B7104KAHT; MPN: GMK107B7104KAHT; TOLERANCE: 10%; VOLTAGE: 35V
C31-C33 = HyTechDevices:CAPACITOR_?_*: Capacitor, Non-Polarized VJ...1BC Series Datasheet <https://www.mouser.com/datasheet/2/427/vjw1bcbascomseries-1762447.pdf> Samsung Datasheet <https://www.mouser.com/datasheet/2/585/MLCC-1837944.pdf> Walsin Datasheet <https://www.mouser.com/datasheet/2/210/WTC_MLCC_General_Purpose-1534899.pdf> GRM188R61A226ME15D <https://www.mouser.com/datasheet/2/281/1/GRM188R61A226ME15_02A-1985787.pdf> GRM188R61E106MA73D <https://www.mouser.com/datasheet/2/281/1/GRM188R61E106MA73_01A-1985806.pdf> 885012006013 <https://www.mouser.com/datasheet/2/445/885012006013-1726946.pdf> 2220Y6300105KXTWS2 <https://www.mouser.com/datasheet/2/218/SMD_High_and_Std_StackiCap_P62-1825512.pdf> Yageo Class 2, X5R <https://www.mouser.com/datasheet/2/447/UPY_GPHC_X5R_4V_to_50V_26-1827097.pdf> TDK C Series <https://www.mouser.com/ProductDetail/TDK/C3216X5R1V226M160AC?qs=%2Fha2pyFadujbcx9jh7lYl%2F4NeMoXFhdc8AqVWNq4wW6M2y7zl6GzBuhgtI0ngznN> AVX Automotive MLCC <https://www.mouser.com/datasheet/2/40/AutoMLCC-777028.pdf> KEMET X7R Series <https://www.mouser.com/datasheet/2/212/KEM_C1002_X7R_SMD-1102033.pdf>; CAPACITANCE: 1µF; DKPN: 445-2304-2-ND; MANUFACTURER: TDK Corporation; MOPN: 810-C5750X7R2E105K; MPN: C5750X7R2E105K230KA; TOLERANCE: 10%; VOLTAGE: 250V
C34 = HyTechDevices:CAPACITOR_?_*: Capacitor, Non-Polarized VJ...1BC Series Datasheet <https://www.mouser.com/datasheet/2/427/vjw1bcbascomseries-1762447.pdf> Samsung Datasheet <https://www.mouser.com/datasheet/2/585/MLCC-1837944.pdf> Walsin Datasheet <https://www.mouser.com/datasheet/2/210/WTC_MLCC_General_Purpose-1534899.pdf> GRM188R61A226ME15D <https://www.mouser.com/datasheet/2/281/1/GRM188R61A226ME15_02A-1985787.pdf> GRM188R61E106MA73D <https://www.mouser.com/datasheet/2/281/1/GRM188R61E106MA73_01A-1985806.pdf> 885012006013 <https://www.mouser.com/datasheet/2/445/885012006013-1726946.pdf> 2220Y6300105KXTWS2 <https://www.mouser.com/datasheet/2/218/SMD_High_and_Std_StackiCap_P62-1825512.pdf> Yageo Class 2, X5R <https://www.mouser.com/datasheet/2/447/UPY_GPHC_X5R_4V_to_50V_26-1827097.pdf> TDK C Series <https://www.mouser.com/ProductDetail/TDK/C3216X5R1V226M160AC?qs=%2Fha2pyFadujbcx9jh7lYl%2F4NeMoXFhdc8AqVWNq4wW6M2y7zl6GzBuhgtI0ngznN> AVX Automotive MLCC <https://www.mouser.com/datasheet/2/40/AutoMLCC-777028.pdf> KEMET X7R Series <https://www.mouser.com/datasheet/2/212/KEM_C1002_X7R_SMD-1102033.pdf>; CAPACITANCE: 22µF; DKPN: 311-1903-1-ND; MANUFACTURER: Yageo; MOPN: 603-CC805MKX5R8BB226; MPN: CC0805MKX5R8BB226; TOLERANCE: 20%; VOLTAGE: 25V
C35 C48 C49 = HyTechDevices:CAPACITOR_?_*: Capacitor, Non-Polarized VJ...1BC Series Datasheet <https://www.mouser.com/datasheet/2/427/vjw1bcbascomseries-1762447.pdf> Samsung Datasheet <https://www.mouser.com/datasheet/2/585/MLCC-1837944.pdf> Walsin Datasheet <https://www.mouser.com/datasheet/2/210/WTC_MLCC_General_Purpose-1534899.pdf> GRM188R61A226ME15D <https://www.mouser.com/datasheet/2/281/1/GRM188R61A226ME15_02A-1985787.pdf> GRM188R61E106MA73D <https://www.mouser.com/datasheet/2/281/1/GRM188R61E106MA73_01A-1985806.pdf> 885012006013 <https://www.mouser.com/datasheet/2/445/885012006013-1726946.pdf> 2220Y6300105KXTWS2 <https://www.mouser.com/datasheet/2/218/SMD_High_and_Std_StackiCap_P62-1825512.pdf> Yageo Class 2, X5R <https://www.mouser.com/datasheet/2/447/UPY_GPHC_X5R_4V_to_50V_26-1827097.pdf> TDK C Series <https://www.mouser.com/ProductDetail/TDK/C3216X5R1V226M160AC?qs=%2Fha2pyFadujbcx9jh7lYl%2F4NeMoXFhdc8AqVWNq4wW6M2y7zl6GzBuhgtI0ngznN> AVX Automotive MLCC <https://www.mouser.com/datasheet/2/40/AutoMLCC-777028.pdf> KEMET X7R Series <https://www.mouser.com/datasheet/2/212/KEM_C1002_X7R_SMD-1102033.pdf>; CAPACITANCE: 10nF; DKPN: 311-4054-1-ND; MANUFACTURER: Yageo; MOPN: 603-CC603KRX7R6BB103; MPN: CC0603KRX7R6BB103; TOLERANCE: 10%; VOLTAGE: 10V
C38-C41 C44-C47 = HyTechDevices:CAPACITOR_?_*: Capacitor, Non-Polarized VJ...1BC Series Datasheet <https://www.mouser.com/datasheet/2/427/vjw1bcbascomseries-1762447.pdf> Samsung Datasheet <https://www.mouser.com/datasheet/2/585/MLCC-1837944.pdf> Walsin Datasheet <https://www.mouser.com/datasheet/2/210/WTC_MLCC_General_Purpose-1534899.pdf> GRM188R61A226ME15D <https://www.mouser.com/datasheet/2/281/1/GRM188R61A226ME15_02A-1985787.pdf> GRM188R61E106MA73D <https://www.mouser.com/datasheet/2/281/1/GRM188R61E106MA73_01A-1985806.pdf> 885012006013 <https://www.mouser.com/datasheet/2/445/885012006013-1726946.pdf> 2220Y6300105KXTWS2 <https://www.mouser.com/datasheet/2/218/SMD_High_and_Std_StackiCap_P62-1825512.pdf> Yageo Class 2, X5R <https://www.mouser.com/datasheet/2/447/UPY_GPHC_X5R_4V_to_50V_26-1827097.pdf> TDK C Series <https://www.mouser.com/ProductDetail/TDK/C3216X5R1V226M160AC?qs=%2Fha2pyFadujbcx9jh7lYl%2F4NeMoXFhdc8AqVWNq4wW6M2y7zl6GzBuhgtI0ngznN> AVX Automotive MLCC <https://www.mouser.com/datasheet/2/40/AutoMLCC-777028.pdf> KEMET X7R Series <https://www.mouser.com/datasheet/2/212/KEM_C1002_X7R_SMD-1102033.pdf>; CAPACITANCE: 1µF; DKPN: 311-1796-1-ND; MANUFACTURER: Yageo; MOPN: 603-CC603KRX7R6BB105; MPN: CC0603KRX7R6BB105; TOLERANCE: 10%; VOLTAGE: 10V
D1 = HyTechDevices:TVS_*: TVS Diode GSOT Datasheet <https://www.mouser.com/datasheet/2/427/gsot03-1767593.pdf>; DKPN: GSOT08-E3-08TR-ND; MANUFACTURER: Vishay General Semiconductor - Diodes Division; MOPN: 78-GSOT08-E3-08; MPN: GSOT08-E3-08; VOLTAGE: 8V
D2 = HyTechDevices:LED_?_*: LED Blue <https://www.mouser.com/datasheet/2/216/APT1608VBC_D-246010.pdf> Green <https://www.mouser.com/datasheet/2/216/APT1608ZGCK-1173388.pdf> Orange <https://www.mouser.com/datasheet/2/216/APT1608SECK-6197.pdf> Red <https://www.mouser.com/datasheet/2/216/APT1608SECK-J3-PRV-1173336.pdf> White <https://www.mouser.com/datasheet/2/50/SM0603UWC-880813.pdf> Yellow <https://www.mouser.com/datasheet/2/216/APT1608SYCK-J3-PRV-1173311.pdf>; COLOR: Orange; DKPN: 754-1120-1-ND; MANUFACTURER: Kingbright; MOPN: 604-APT1608SECK; MPN: APT1608SECK
D3 = HyTechDevices:LED_?_*: LED Blue <https://www.mouser.com/datasheet/2/216/APT1608VBC_D-246010.pdf> Green <https://www.mouser.com/datasheet/2/216/APT1608ZGCK-1173388.pdf> Orange <https://www.mouser.com/datasheet/2/216/APT1608SECK-6197.pdf> Red <https://www.mouser.com/datasheet/2/216/APT1608SECK-J3-PRV-1173336.pdf> White <https://www.mouser.com/datasheet/2/50/SM0603UWC-880813.pdf> Yellow <https://www.mouser.com/datasheet/2/216/APT1608SYCK-J3-PRV-1173311.pdf>; COLOR: Yellow; DKPN: 754-1788-1-ND; MANUFACTURER: Kingbright; MOPN: 604-APT1608SYCK/J3-PRV; MPN: APT1608SYCK/J3-PRV
D4 = HyTechDevices:LED_?_*: LED Blue <https://www.mouser.com/datasheet/2/216/APT1608VBC_D-246010.pdf> Green <https://www.mouser.com/datasheet/2/216/APT1608ZGCK-1173388.pdf> Orange <https://www.mouser.com/datasheet/2/216/APT1608SECK-6197.pdf> Red <https://www.mouser.com/datasheet/2/216/APT1608SECK-J3-PRV-1173336.pdf> White <https://www.mouser.com/datasheet/2/50/SM0603UWC-880813.pdf> Yellow <https://www.mouser.com/datasheet/2/216/APT1608SYCK-J3-PRV-1173311.pdf>; COLOR: Green; DKPN: 754-1790-1-ND; MANUFACTURER: Kingbright; MOPN: 604-APT1608ZGCK; MPN: APT1608ZGCK
D5 D12 = HyTechDevices:LED_?_*: LED Blue <https://www.mouser.com/datasheet/2/216/APT1608VBC_D-246010.pdf> Green <https://www.mouser.com/datasheet/2/216/APT1608ZGCK-1173388.pdf> Orange <https://www.mouser.com/datasheet/2/216/APT1608SECK-6197.pdf> Red <https://www.mouser.com/datasheet/2/216/APT1608SECK-J3-PRV-1173336.pdf> White <https://www.mouser.com/datasheet/2/50/SM0603UWC-880813.pdf> Yellow <https://www.mouser.com/datasheet/2/216/APT1608SYCK-J3-PRV-1173311.pdf>; COLOR: White; DKPN: SM0603UWC-ND; MANUFACTURER: Bivar Inc.; MOPN: 749-SM0603UWC; MPN: SM0603UWC
D6 = HyTechDevices:LED_?_*: LED Blue <https://www.mouser.com/datasheet/2/216/APT1608VBC_D-246010.pdf> Green <https://www.mouser.com/datasheet/2/216/APT1608ZGCK-1173388.pdf> Orange <https://www.mouser.com/datasheet/2/216/APT1608SECK-6197.pdf> Red <https://www.mouser.com/datasheet/2/216/APT1608SECK-J3-PRV-1173336.pdf> White <https://www.mouser.com/datasheet/2/50/SM0603UWC-880813.pdf> Yellow <https://www.mouser.com/datasheet/2/216/APT1608SYCK-J3-PRV-1173311.pdf>; COLOR: Red; DKPN: 754-1786-1-ND; MANUFACTURER: Kingbright; MOPN: 604-APT1608SECKJ3PRV; MPN: APT1608SECK/J3-PRV
D7 D8 D10 = HyTechDevices:SCHOTTKY: Schottky Rectifier Diode Datasheet <https://www.vishay.com/docs/85892/vsky20401608.pdf>; DKPN: 112-VSKY20401608-G4-08CT-ND; MANUFACTURER: Vishay General Semiconductor - Diodes Division; MOPN: 78-VSKY20401608G408; MPN: VSKY20401608-G4-08
D9 D11 D13 = HyTechDevices:LED_?_*: LED Blue <https://www.mouser.com/datasheet/2/216/APT1608VBC_D-246010.pdf> Green <https://www.mouser.com/datasheet/2/216/APT1608ZGCK-1173388.pdf> Orange <https://www.mouser.com/datasheet/2/216/APT1608SECK-6197.pdf> Red <https://www.mouser.com/datasheet/2/216/APT1608SECK-J3-PRV-1173336.pdf> White <https://www.mouser.com/datasheet/2/50/SM0603UWC-880813.pdf> Yellow <https://www.mouser.com/datasheet/2/216/APT1608SYCK-J3-PRV-1173311.pdf>; COLOR: Blue; DKPN: 754-1789-1-ND; MANUFACTURER: Kingbright; MOPN: 604-APT1608VBC/D; MPN: APT1608VBC/D
F1 = HyTechDevices:FUSE_?_*: Fuse 0885 Series <https://www.mouser.com/datasheet/2/240/Littelfuse_Fuse_885_Datasheet_pdf-1371443.pdf>; CURRENT: 10A; DKPN: F991-ND; MANUFACTURER: Littelfuse Inc.; MOPN: 576-0297010.WXNV; MPN: 0297010.WXNV; VOLTAGE: 32V
F2 F6 = HyTechDevices:FUSE_?_*: Fuse 0885 Series <https://www.mouser.com/datasheet/2/240/Littelfuse_Fuse_885_Datasheet_pdf-1371443.pdf>; CURRENT: 1.25A; DKPN: F10986CT-ND; MANUFACTURER: Littelfuse Inc.; MOPN: 576-08851.25DR; MPN: 08851.25DR; VOLTAGE: 500V
J3 = HyTechDevices:CONNECTOR-8_?_*: 8 Pin Connector; MANUFACTURER: Molex; MPN: 2068320823
J5 = HyTechDevices:CONNECTOR-4_?_*; MANUFACTURER: Molex; MPN: 2068320423
K4 = HyTechDevices:RELAY_SPST_NC_POLARIZED_?*: Single Pole, Single Throw Normally Closed Polarized Relay 355x Series <https://www.comus-intl.com/wp-content/uploads/2017/01/High-Voltage-Reed-Relays.pdf> D Series <https://www.mouser.com/datasheet/2/657/cynergy3_d_pcb_v2-1892244.pdf>; DKPN: 1835-1040-ND; MANUFACTURER: Comus International; MPN: 3350-4275-126
K5 = HyTechDevices:RELAY_SPST_NO_?*: Single Pole, Single Throw Relay Normally Open 355x Series <https://www.comus-intl.com/wp-content/uploads/2017/01/High-Voltage-Reed-Relays.pdf>; DKPN: 1835-1037-ND; MANUFACTURER: Comus International; MPN: 3350-1275-126
L4 = HyTechDevices:INDUCTOR_?_*: Inductor 74451133 Inductor <https://www.we-online.com/catalog/datasheet/74451133.pdf> SRU1408 Datasheet <https://www.mouser.com/datasheet/2/54/SRU1048-1391431.pdf> PA4334 Datasheet <https://www.mouser.com/datasheet/2/336/plei_s_a0002827602_1-2281222.pdf> WE-LMHI Datasheet <https://www.mouser.com/datasheet/2/445/74437349560-1721693.pdf>; CURRENT_RATED: 1.6A; CURRENT_SATURATION: 1A; DCR: 0.13; DKPN: 553-3508-2-ND; INDUCTANCE: 3.6uH; MANUFACTURER: Pulse Electonics Company; MOPN: 673-PA4334362NLT; MPN: PA4334.362NLT; TOLERANCE: 20%
L5 = HyTechDevices:INDUCTOR_?_*: Inductor 74451133 Inductor <https://www.we-online.com/catalog/datasheet/74451133.pdf> SRU1408 Datasheet <https://www.mouser.com/datasheet/2/54/SRU1048-1391431.pdf> PA4334 Datasheet <https://www.mouser.com/datasheet/2/336/plei_s_a0002827602_1-2281222.pdf> WE-LMHI Datasheet <https://www.mouser.com/datasheet/2/445/74437349560-1721693.pdf>; CURRENT_RATED: 1.4A; CURRENT_SATURATION: 1.4A; DCR: 342m; DKPN: 732-11454-2-ND; INDUCTANCE: 56uH; MANUFACTURER: Wurth Elektronik; MOPN: 710-74437349560; MPN: 74437349560; TOLERANCE: 20%
L6 = HyTechDevices:INDUCTOR_?_*: Inductor 74451133 Inductor <https://www.we-online.com/catalog/datasheet/74451133.pdf> SRU1408 Datasheet <https://www.mouser.com/datasheet/2/54/SRU1048-1391431.pdf> PA4334 Datasheet <https://www.mouser.com/datasheet/2/336/plei_s_a0002827602_1-2281222.pdf> WE-LMHI Datasheet <https://www.mouser.com/datasheet/2/445/74437349560-1721693.pdf>; CURRENT_RATED: 0.65A; CURRENT_SATURATION: 0.52A; DCR: 0.640Ω; DKPN: SRU1048-331YTR-ND; INDUCTANCE: 330µH; MANUFACTURER: Bourns Inc.; MOPN: 652-SRU1048-331Y; MPN: SRU1048-331Y; TOLERANCE: 30%
Q2 = HyTechDevices:TRANSISTOR_N_MOS_?_*: N-MOSFET PMV15ENEA Datasheet <https://www.mouser.com/datasheet/2/916/PMV15ENEA-1604828.pdf> TK6P65W Datasheet <https://www.mouser.com/datasheet/2/408/TK6P65W_datasheet_en_20151225-1916290.pdf> SIR638ADP Datasheet <https://www.mouser.com/datasheet/2/427/sir638adp-1766131.pdf>; DKPN: 1727-8588-1-ND; MANUFACTURER: Nexperia USA Inc.; MOPN: 771-PMV15ENEAR; MPN: PMV15ENEAR
R1 R2 = HyTechDevices:RESISTOR_?_*: Resistor PWR163 Series <https://www.mouser.com/datasheet/2/54/pwr163-777985.pdf> AC Series <https://www.mouser.com/datasheet/2/447/Yageo_PYu_AC_51_RoHS_L_7_1714230-1874691.pdf> PU Series <https://www.mouser.com/datasheet/2/447/PYu-PU_51_RoHS_L_6-1504619.pdf> ERA Series <https://www.mouser.com/datasheet/2/315/AOA0000C307-1149632.pdf> PWR263 Series <https://www.mouser.com/datasheet/2/54/pwr263s_35-778069.pdf> RC Series <https://www.mouser.com/datasheet/2/447/Yageo_03_18_2021_PYu_RC_Group_51_RoHS_L_11-2199992.pdf> ERJ PB3, PB6 Series <https://www.mouser.com/datasheet/2/315/AOA0000C328-1530132.pdf> ERJ PA2, P03, PA3, P06, P08, P14 Series <https://www.mouser.com/datasheet/2/315/AOA0000C331-1141874.pdf>; DKPN: P5.9KDBCT-ND; MANUFACTURER: Panasonic Electronic Components; MOPN: 667-ERA-3AEB5901V; MPN: ERA-3AEB5901V; POWER: 0.1W; RESISTANCE: 5.9k; TOLERANCE: 0.1%; VOLTAGE_CONTINUOUS: 24.29V; VOLTAGE_MAX: 75V
R3 = HyTechDevices:RESISTOR_?_*: Resistor PWR163 Series <https://www.mouser.com/datasheet/2/54/pwr163-777985.pdf> AC Series <https://www.mouser.com/datasheet/2/447/Yageo_PYu_AC_51_RoHS_L_7_1714230-1874691.pdf> PU Series <https://www.mouser.com/datasheet/2/447/PYu-PU_51_RoHS_L_6-1504619.pdf> ERA Series <https://www.mouser.com/datasheet/2/315/AOA0000C307-1149632.pdf> PWR263 Series <https://www.mouser.com/datasheet/2/54/pwr263s_35-778069.pdf> RC Series <https://www.mouser.com/datasheet/2/447/Yageo_03_18_2021_PYu_RC_Group_51_RoHS_L_11-2199992.pdf> ERJ PB3, PB6 Series <https://www.mouser.com/datasheet/2/315/AOA0000C328-1530132.pdf> ERJ PA2, P03, PA3, P06, P08, P14 Series <https://www.mouser.com/datasheet/2/315/AOA0000C331-1141874.pdf>; DKPN: YAG4603TR-ND; MANUFACTURER: Yageo; MOPN: 603-RT0603BRD078K66L; MPN: RT0603BRD078K66L; POWER: 0.1W; RESISTANCE: 8.66k; TOLERANCE: 0.1%; VOLTAGE_CONTINUOUS: 29.43V; VOLTAGE_MAX: 75V
R4 = HyTechDevices:RESISTOR_?_*: Resistor PWR163 Series <https://www.mouser.com/datasheet/2/54/pwr163-777985.pdf> AC Series <https://www.mouser.com/datasheet/2/447/Yageo_PYu_AC_51_RoHS_L_7_1714230-1874691.pdf> PU Series <https://www.mouser.com/datasheet/2/447/PYu-PU_51_RoHS_L_6-1504619.pdf> ERA Series <https://www.mouser.com/datasheet/2/315/AOA0000C307-1149632.pdf> PWR263 Series <https://www.mouser.com/datasheet/2/54/pwr263s_35-778069.pdf> RC Series <https://www.mouser.com/datasheet/2/447/Yageo_03_18_2021_PYu_RC_Group_51_RoHS_L_11-2199992.pdf> ERJ PB3, PB6 Series <https://www.mouser.com/datasheet/2/315/AOA0000C328-1530132.pdf> ERJ PA2, P03, PA3, P06, P08, P14 Series <https://www.mouser.com/datasheet/2/315/AOA0000C331-1141874.pdf>; DKPN: P20098TR-ND; MANUFACTURER: Panasonic Electronic Components; MOPN: 667-ERJ-PB3B1302V; MPN: ERJ-PB3B1302V; POWER: 0.1W; RESISTANCE: 13k; TOLERANCE: 0.1%; VOLTAGE_CONTINUOUS: 36V; VOLTAGE_MAX: 75V
R5 = HyTechDevices:RESISTOR_?_*: Resistor PWR163 Series <https://www.mouser.com/datasheet/2/54/pwr163-777985.pdf> AC Series <https://www.mouser.com/datasheet/2/447/Yageo_PYu_AC_51_RoHS_L_7_1714230-1874691.pdf> PU Series <https://www.mouser.com/datasheet/2/447/PYu-PU_51_RoHS_L_6-1504619.pdf> ERA Series <https://www.mouser.com/datasheet/2/315/AOA0000C307-1149632.pdf> PWR263 Series <https://www.mouser.com/datasheet/2/54/pwr263s_35-778069.pdf> RC Series <https://www.mouser.com/datasheet/2/447/Yageo_03_18_2021_PYu_RC_Group_51_RoHS_L_11-2199992.pdf> ERJ PB3, PB6 Series <https://www.mouser.com/datasheet/2/315/AOA0000C328-1530132.pdf> ERJ PA2, P03, PA3, P06, P08, P14 Series <https://www.mouser.com/datasheet/2/315/AOA0000C331-1141874.pdf>; DKPN: P20935TR-ND; MANUFACTURER: Panasonic Electronic Components; MOPN: 667-ERJ-PB6B9763V; MPN: ERJ-PB6B9763V; POWER: 0.25W; RESISTANCE: 976k; TOLERANCE: 0.1%; VOLTAGE_CONTINUOUS: 150V; VOLTAGE_MAX: 150V
R6-R9 R16-R19 R43 = HyTechDevices:RESISTOR_?_*: Resistor PWR163 Series <https://www.mouser.com/datasheet/2/54/pwr163-777985.pdf> AC Series <https://www.mouser.com/datasheet/2/447/Yageo_PYu_AC_51_RoHS_L_7_1714230-1874691.pdf> PU Series <https://www.mouser.com/datasheet/2/447/PYu-PU_51_RoHS_L_6-1504619.pdf> ERA Series <https://www.mouser.com/datasheet/2/315/AOA0000C307-1149632.pdf> PWR263 Series <https://www.mouser.com/datasheet/2/54/pwr263s_35-778069.pdf> RC Series <https://www.mouser.com/datasheet/2/447/Yageo_03_18_2021_PYu_RC_Group_51_RoHS_L_11-2199992.pdf> ERJ PB3, PB6 Series <https://www.mouser.com/datasheet/2/315/AOA0000C328-1530132.pdf> ERJ PA2, P03, PA3, P06, P08, P14 Series <https://www.mouser.com/datasheet/2/315/AOA0000C331-1141874.pdf>; DKPN: P20885CT-ND; MANUFACTURER: Panasonic Electronic Components; MOPN: 667-ERJ-PB6B3653V; MPN: ERJ-PB6B3653V; POWER: 0.25W; RESISTANCE: 365k; TOLERANCE: 0.1%; VOLTAGE_CONTINUOUS: 150V; VOLTAGE_MAX: 150V
R10-R15 R20-R25 R49 R50 = HyTechDevices:RESISTOR_?_*: Resistor PWR163 Series <https://www.mouser.com/datasheet/2/54/pwr163-777985.pdf> AC Series <https://www.mouser.com/datasheet/2/447/Yageo_PYu_AC_51_RoHS_L_7_1714230-1874691.pdf> PU Series <https://www.mouser.com/datasheet/2/447/PYu-PU_51_RoHS_L_6-1504619.pdf> ERA Series <https://www.mouser.com/datasheet/2/315/AOA0000C307-1149632.pdf> PWR263 Series <https://www.mouser.com/datasheet/2/54/pwr263s_35-778069.pdf> RC Series <https://www.mouser.com/datasheet/2/447/Yageo_03_18_2021_PYu_RC_Group_51_RoHS_L_11-2199992.pdf> ERJ PB3, PB6 Series <https://www.mouser.com/datasheet/2/315/AOA0000C328-1530132.pdf> ERJ PA2, P03, PA3, P06, P08, P14 Series <https://www.mouser.com/datasheet/2/315/AOA0000C331-1141874.pdf>; DKPN: P20144TR-ND; MANUFACTURER: Panasonic Electronic Components; MOPN: 667-ERJ-PB3B3322V; MPN: ERJ-PB3B3322V; POWER: 0.1W; RESISTANCE: 33.2k; TOLERANCE: 0.1%; VOLTAGE_CONTINUOUS: 57.6V; VOLTAGE_MAX: 75V
R26 = HyTechDevices:RESISTOR_?_*: Resistor PWR163 Series <https://www.mouser.com/datasheet/2/54/pwr163-777985.pdf> AC Series <https://www.mouser.com/datasheet/2/447/Yageo_PYu_AC_51_RoHS_L_7_1714230-1874691.pdf> PU Series <https://www.mouser.com/datasheet/2/447/PYu-PU_51_RoHS_L_6-1504619.pdf> ERA Series <https://www.mouser.com/datasheet/2/315/AOA0000C307-1149632.pdf> PWR263 Series <https://www.mouser.com/datasheet/2/54/pwr263s_35-778069.pdf> RC Series <https://www.mouser.com/datasheet/2/447/Yageo_03_18_2021_PYu_RC_Group_51_RoHS_L_11-2199992.pdf> ERJ PB3, PB6 Series <https://www.mouser.com/datasheet/2/315/AOA0000C328-1530132.pdf> ERJ PA2, P03, PA3, P06, P08, P14 Series <https://www.mouser.com/datasheet/2/315/AOA0000C331-1141874.pdf>; DKPN: P1.0DTR-ND; MANUFACTURER: Panasonic Electronic Components; MOPN: 667-ERJ-6RQF1R0V; MPN: ERJ-6RQF1R0V; POWER: 0.125W; RESISTANCE: 1; TOLERANCE: 1%; VOLTAGE_CONTINUOUS: 0.35V; VOLTAGE_MAX: 150V
R27 = HyTechDevices:RESISTOR_?_*: Resistor PWR163 Series <https://www.mouser.com/datasheet/2/54/pwr163-777985.pdf> AC Series <https://www.mouser.com/datasheet/2/447/Yageo_PYu_AC_51_RoHS_L_7_1714230-1874691.pdf> PU Series <https://www.mouser.com/datasheet/2/447/PYu-PU_51_RoHS_L_6-1504619.pdf> ERA Series <https://www.mouser.com/datasheet/2/315/AOA0000C307-1149632.pdf> PWR263 Series <https://www.mouser.com/datasheet/2/54/pwr263s_35-778069.pdf> RC Series <https://www.mouser.com/datasheet/2/447/Yageo_03_18_2021_PYu_RC_Group_51_RoHS_L_11-2199992.pdf> ERJ PB3, PB6 Series <https://www.mouser.com/datasheet/2/315/AOA0000C328-1530132.pdf> ERJ PA2, P03, PA3, P06, P08, P14 Series <https://www.mouser.com/datasheet/2/315/AOA0000C331-1141874.pdf>; DKPN: P12.4CTR-ND; MANUFACTURER: Panasonic Electronic Components; MOPN: 667-ERJ-6ENF12R4V; MPN: ERJ-6ENF12R4V; POWER: .125W; RESISTANCE: 12.4; TOLERANCE: 1%; VOLTAGE_CONTINUOUS: 1.24V; VOLTAGE_MAX: 150V
R28-R30 R32 R34-R36 R52-R55 R63 = HyTechDevices:RESISTOR_?_*: Resistor PWR163 Series <https://www.mouser.com/datasheet/2/54/pwr163-777985.pdf> AC Series <https://www.mouser.com/datasheet/2/447/Yageo_PYu_AC_51_RoHS_L_7_1714230-1874691.pdf> PU Series <https://www.mouser.com/datasheet/2/447/PYu-PU_51_RoHS_L_6-1504619.pdf> ERA Series <https://www.mouser.com/datasheet/2/315/AOA0000C307-1149632.pdf> PWR263 Series <https://www.mouser.com/datasheet/2/54/pwr263s_35-778069.pdf> RC Series <https://www.mouser.com/datasheet/2/447/Yageo_03_18_2021_PYu_RC_Group_51_RoHS_L_11-2199992.pdf> ERJ PB3, PB6 Series <https://www.mouser.com/datasheet/2/315/AOA0000C328-1530132.pdf> ERJ PA2, P03, PA3, P06, P08, P14 Series <https://www.mouser.com/datasheet/2/315/AOA0000C331-1141874.pdf>; DKPN: 311-1.00KHRCT-ND; MANUFACTURER: Yageo; MOPN: 603-RC0603FR-071KL; MPN: RC0603FR-071KL; POWER: 0.1W; RESISTANCE: 1k; TOLERANCE: 1%; VOLTAGE_CONTINUOUS: 10.00V; VOLTAGE_MAX: 75V
R31 = HyTechDevices:RESISTOR_?_*: Resistor PWR163 Series <https://www.mouser.com/datasheet/2/54/pwr163-777985.pdf> AC Series <https://www.mouser.com/datasheet/2/447/Yageo_PYu_AC_51_RoHS_L_7_1714230-1874691.pdf> PU Series <https://www.mouser.com/datasheet/2/447/PYu-PU_51_RoHS_L_6-1504619.pdf> ERA Series <https://www.mouser.com/datasheet/2/315/AOA0000C307-1149632.pdf> PWR263 Series <https://www.mouser.com/datasheet/2/54/pwr263s_35-778069.pdf> RC Series <https://www.mouser.com/datasheet/2/447/Yageo_03_18_2021_PYu_RC_Group_51_RoHS_L_11-2199992.pdf> ERJ PB3, PB6 Series <https://www.mouser.com/datasheet/2/315/AOA0000C328-1530132.pdf> ERJ PA2, P03, PA3, P06, P08, P14 Series <https://www.mouser.com/datasheet/2/315/AOA0000C331-1141874.pdf>; DKPN: 1712-CPF0603B1R62E1TR-ND; MANUFACTURER: TE Conductivity Passive Product; MOPN: 279-CPF0603B1R62E1; MPN: CPF0603B1R62E1; POWER: 0.1W; RESISTANCE: 1.62; TOLERANCE: 0.1%; VOLTAGE_CONTINUOUS: 0.51V; VOLTAGE_MAX: 50V
R33 = HyTechDevices:RESISTOR_?_*: Resistor PWR163 Series <https://www.mouser.com/datasheet/2/54/pwr163-777985.pdf> AC Series <https://www.mouser.com/datasheet/2/447/Yageo_PYu_AC_51_RoHS_L_7_1714230-1874691.pdf> PU Series <https://www.mouser.com/datasheet/2/447/PYu-PU_51_RoHS_L_6-1504619.pdf> ERA Series <https://www.mouser.com/datasheet/2/315/AOA0000C307-1149632.pdf> PWR263 Series <https://www.mouser.com/datasheet/2/54/pwr263s_35-778069.pdf> RC Series <https://www.mouser.com/datasheet/2/447/Yageo_03_18_2021_PYu_RC_Group_51_RoHS_L_11-2199992.pdf> ERJ PB3, PB6 Series <https://www.mouser.com/datasheet/2/315/AOA0000C328-1530132.pdf> ERJ PA2, P03, PA3, P06, P08, P14 Series <https://www.mouser.com/datasheet/2/315/AOA0000C331-1141874.pdf>; RESISTANCE: DNP
R37 = HyTechDevices:RESISTOR_?_*: Resistor PWR163 Series <https://www.mouser.com/datasheet/2/54/pwr163-777985.pdf> AC Series <https://www.mouser.com/datasheet/2/447/Yageo_PYu_AC_51_RoHS_L_7_1714230-1874691.pdf> PU Series <https://www.mouser.com/datasheet/2/447/PYu-PU_51_RoHS_L_6-1504619.pdf> ERA Series <https://www.mouser.com/datasheet/2/315/AOA0000C307-1149632.pdf> PWR263 Series <https://www.mouser.com/datasheet/2/54/pwr263s_35-778069.pdf> RC Series <https://www.mouser.com/datasheet/2/447/Yageo_03_18_2021_PYu_RC_Group_51_RoHS_L_11-2199992.pdf> ERJ PB3, PB6 Series <https://www.mouser.com/datasheet/2/315/AOA0000C328-1530132.pdf> ERJ PA2, P03, PA3, P06, P08, P14 Series <https://www.mouser.com/datasheet/2/315/AOA0000C331-1141874.pdf>; DKPN: 311-10.0HRCT-ND; MANUFACTURER: Yageo; MOPN: 603-RC0603FR-0710RL; MPN: RC0603FR-0710RL; POWER: 0.1W; RESISTANCE: 10; TOLERANCE: 1%; VOLTAGE_CONTINUOUS: 1V; VOLTAGE_MAX: 75V
R38 R47 = HyTechDevices:RESISTOR_?_*: Resistor PWR163 Series <https://www.mouser.com/datasheet/2/54/pwr163-777985.pdf> AC Series <https://www.mouser.com/datasheet/2/447/Yageo_PYu_AC_51_RoHS_L_7_1714230-1874691.pdf> PU Series <https://www.mouser.com/datasheet/2/447/PYu-PU_51_RoHS_L_6-1504619.pdf> ERA Series <https://www.mouser.com/datasheet/2/315/AOA0000C307-1149632.pdf> PWR263 Series <https://www.mouser.com/datasheet/2/54/pwr263s_35-778069.pdf> RC Series <https://www.mouser.com/datasheet/2/447/Yageo_03_18_2021_PYu_RC_Group_51_RoHS_L_11-2199992.pdf> ERJ PB3, PB6 Series <https://www.mouser.com/datasheet/2/315/AOA0000C328-1530132.pdf> ERJ PA2, P03, PA3, P06, P08, P14 Series <https://www.mouser.com/datasheet/2/315/AOA0000C331-1141874.pdf>; DKPN: 311-10.0KHRCT-ND; MANUFACTURER: Yageo; MOPN: 603-RC0603FR-0710KL; MPN: RC0603FR-0710KL; POWER: 0.1W; RESISTANCE: 10k; TOLERANCE: 1%; VOLTAGE_CONTINUOUS: 31.62V; VOLTAGE_MAX: 75V
R39 = HyTechDevicesTempTSB:RESISTOR_GND_*: 20W Axial Through Hole Resistor Datasheet <https://www.ohmite.com/assets/docs/res_200.pdf?r=false>; DKPN: B20J750E-ND; MANUFACTURER: Ohmite; MOPN: 588-B20J750E; MPN: B20J750E; POWER: 20W; RESISTANCE: 750; TOLERANCE: 5%; VOLTAGE_CONTINUOUS: 122V; VOLTAGE_MAX: 750V
R40-R42 = HyTechDevicesTempTSB:RESISTOR_GND_*: 20W Axial Through Hole Resistor Datasheet <https://www.ohmite.com/assets/docs/res_200.pdf?r=false>; DKPN: B20J10KE-ND; MANUFACTURER: Ohmite; MOPN: 588-B20J10KE; MPN: B20J10KE; POWER: 20W; RESISTANCE: 10k; TOLERANCE: 5%; VOLTAGE_CONTINUOUS: 447V; VOLTAGE_MAX: 750V
R44 = HyTechDevices:RESISTOR_?_*: Resistor PWR163 Series <https://www.mouser.com/datasheet/2/54/pwr163-777985.pdf> AC Series <https://www.mouser.com/datasheet/2/447/Yageo_PYu_AC_51_RoHS_L_7_1714230-1874691.pdf> PU Series <https://www.mouser.com/datasheet/2/447/PYu-PU_51_RoHS_L_6-1504619.pdf> ERA Series <https://www.mouser.com/datasheet/2/315/AOA0000C307-1149632.pdf> PWR263 Series <https://www.mouser.com/datasheet/2/54/pwr263s_35-778069.pdf> RC Series <https://www.mouser.com/datasheet/2/447/Yageo_03_18_2021_PYu_RC_Group_51_RoHS_L_11-2199992.pdf> ERJ PB3, PB6 Series <https://www.mouser.com/datasheet/2/315/AOA0000C328-1530132.pdf> ERJ PA2, P03, PA3, P06, P08, P14 Series <https://www.mouser.com/datasheet/2/315/AOA0000C331-1141874.pdf>; DKPN: P20936TR-ND; MANUFACTURER: Panasonic Electronic Components; MOPN: 667-ERJ-PB6B1004V; MPN: ERJ-PB6B1004V; POWER: 0.25W; RESISTANCE: 1M; TOLERANCE: 0.1%; VOLTAGE_CONTINUOUS: 150V; VOLTAGE_MAX: 150V
R45 = HyTechDevices:RESISTOR_?_*: Resistor PWR163 Series <https://www.mouser.com/datasheet/2/54/pwr163-777985.pdf> AC Series <https://www.mouser.com/datasheet/2/447/Yageo_PYu_AC_51_RoHS_L_7_1714230-1874691.pdf> PU Series <https://www.mouser.com/datasheet/2/447/PYu-PU_51_RoHS_L_6-1504619.pdf> ERA Series <https://www.mouser.com/datasheet/2/315/AOA0000C307-1149632.pdf> PWR263 Series <https://www.mouser.com/datasheet/2/54/pwr263s_35-778069.pdf> RC Series <https://www.mouser.com/datasheet/2/447/Yageo_03_18_2021_PYu_RC_Group_51_RoHS_L_11-2199992.pdf> ERJ PB3, PB6 Series <https://www.mouser.com/datasheet/2/315/AOA0000C328-1530132.pdf> ERJ PA2, P03, PA3, P06, P08, P14 Series <https://www.mouser.com/datasheet/2/315/AOA0000C331-1141874.pdf>; DKPN: YAG1651TR-ND; MANUFACTURER: Yageo; MOPN: 603-RT0603BRD073K32L; MPN: RT0603BRD073K32L; POWER: 0.1W; RESISTANCE: 3.32k; TOLERANCE: 0.1%; VOLTAGE_CONTINUOUS: 18.22V; VOLTAGE_MAX: 75V
R46 = HyTechDevices:RESISTOR_?_*: Resistor PWR163 Series <https://www.mouser.com/datasheet/2/54/pwr163-777985.pdf> AC Series <https://www.mouser.com/datasheet/2/447/Yageo_PYu_AC_51_RoHS_L_7_1714230-1874691.pdf> PU Series <https://www.mouser.com/datasheet/2/447/PYu-PU_51_RoHS_L_6-1504619.pdf> ERA Series <https://www.mouser.com/datasheet/2/315/AOA0000C307-1149632.pdf> PWR263 Series <https://www.mouser.com/datasheet/2/54/pwr263s_35-778069.pdf> RC Series <https://www.mouser.com/datasheet/2/447/Yageo_03_18_2021_PYu_RC_Group_51_RoHS_L_11-2199992.pdf> ERJ PB3, PB6 Series <https://www.mouser.com/datasheet/2/315/AOA0000C328-1530132.pdf> ERJ PA2, P03, PA3, P06, P08, P14 Series <https://www.mouser.com/datasheet/2/315/AOA0000C331-1141874.pdf>; DKPN: P20904TR-ND; MANUFACTURER: Panasonic Electronic Components; MOPN: 667-ERJ-PB6B5233V; MPN: ERJ-PB6B5233V; POWER: 0.25W; RESISTANCE: 523k; TOLERANCE: 0.1%; VOLTAGE_CONTINUOUS: 150V; VOLTAGE_MAX: 150V
R48 = HyTechDevices:RESISTOR_?_*: Resistor PWR163 Series <https://www.mouser.com/datasheet/2/54/pwr163-777985.pdf> AC Series <https://www.mouser.com/datasheet/2/447/Yageo_PYu_AC_51_RoHS_L_7_1714230-1874691.pdf> PU Series <https://www.mouser.com/datasheet/2/447/PYu-PU_51_RoHS_L_6-1504619.pdf> ERA Series <https://www.mouser.com/datasheet/2/315/AOA0000C307-1149632.pdf> PWR263 Series <https://www.mouser.com/datasheet/2/54/pwr263s_35-778069.pdf> RC Series <https://www.mouser.com/datasheet/2/447/Yageo_03_18_2021_PYu_RC_Group_51_RoHS_L_11-2199992.pdf> ERJ PB3, PB6 Series <https://www.mouser.com/datasheet/2/315/AOA0000C328-1530132.pdf> ERJ PA2, P03, PA3, P06, P08, P14 Series <https://www.mouser.com/datasheet/2/315/AOA0000C331-1141874.pdf>; DKPN: RT0603BRE0775KL-ND; MANUFACTURER: Yageo; MOPN: 603-RT0603BRE0775KL; MPN: RT0603BRE0775KL; POWER: 0.1W; RESISTANCE: 75k; TOLERANCE: 0.1%; VOLTAGE_CONTINUOUS: 75V; VOLTAGE_MAX: 75V
R51 = HyTechDevices:RESISTOR_?_*: Resistor PWR163 Series <https://www.mouser.com/datasheet/2/54/pwr163-777985.pdf> AC Series <https://www.mouser.com/datasheet/2/447/Yageo_PYu_AC_51_RoHS_L_7_1714230-1874691.pdf> PU Series <https://www.mouser.com/datasheet/2/447/PYu-PU_51_RoHS_L_6-1504619.pdf> ERA Series <https://www.mouser.com/datasheet/2/315/AOA0000C307-1149632.pdf> PWR263 Series <https://www.mouser.com/datasheet/2/54/pwr263s_35-778069.pdf> RC Series <https://www.mouser.com/datasheet/2/447/Yageo_03_18_2021_PYu_RC_Group_51_RoHS_L_11-2199992.pdf> ERJ PB3, PB6 Series <https://www.mouser.com/datasheet/2/315/AOA0000C328-1530132.pdf> ERJ PA2, P03, PA3, P06, P08, P14 Series <https://www.mouser.com/datasheet/2/315/AOA0000C331-1141874.pdf>; DKPN: P154KDBCT-ND; MANUFACTURER: Panasonic Electronic Components; MOPN: 667-ERA-3AEB1543V; MPN: ERA-3AEB1543V; POWER: 0.1W; RESISTANCE: 154k; TOLERANCE: 0.1%; VOLTAGE_CONTINUOUS: 75V; VOLTAGE_MAX: 75V
TP1-TP16 TP18-TP20 = HyTechDevices:TEST_POINT: Test Point; DKPN: 36-5015CT-ND; MANUFACTURER: Keystone Electronics; MOPN: 534-5015; MPN: 5015
U1 = HyTechDevices:LTC6994_*: Analog Electronics Delay IC Datasheet <https://www.mouser.com/datasheet/2/609/LTC6994_1_6994_2-1270043.pdf>; DKPN: 505-LTC6994CS6-1#TRMPBFTR-ND; MANUFACTURER: Analog Electronics; MOPN: 584-C6994CS6-1TRMPBF; MPN: LTC6994CS6-1#TRMPBF
U2 = HyTechDevices:VOLTAGE_REGULATOR_?_*: Voltage Regulators LDL1117S50R Datasheet <https://www.mouser.com/datasheet/2/389/dm00366442-1799212.pdf> NCP785AH120T1G <https://www.mouser.com/datasheet/2/308/NCP785A_D-1812704.pdf>; DKPN: 497-17240-1-ND; MANUFACTURER: STMicroelectronics; MOPN: 511-LDL1117S50R; MPN: LDL1117S50R
U10 = HyTechDevicesTempTSB:DCM4623TD2J13D0T70: 400W 300V to 12V step-down DC-DC converter Datasheet <https://www.mouser.com/datasheet/2/685/DCM4623xD2J13D0y7z_ds-1144763.pdf>; DKPN: 1102-DCM4623TD2J13D0T70-ND; MANUFACTURER: Vicor; MOPN: 492-DCM4623D2J13D0T7; MPN: DCM4623TD2J13D0T70
U11 = HyTechDevicesTempTSB:RELAY_SOLIDSTATE_NC_?: Normally Closed Solid-State Relay Datasheet <file:///C:/Users/kamin/Downloads/semi_eng_ge1b_aqy41_e%20(1).pdf>; DKPN: 255-2897-ND; MANUFACTURER: Panasonic Industrial Devices; MOPN: 769-AQY414EHA; MPN: AQY414EHA
U15 = HyTechDevices:LOGICGATE_INVERTER_: Inverter SN74LVC Datasheet <https://www.ti.com/lit/ds/symlink/sn74lvc1g04.pdf>; DKPN: 2156-SN74LVC1G04DCKR-ND; MANUFACTURER: Texas Instruments; MOPN: 595-SN74LVC1G04DCKR; MPN: SN74LVC1G04DCKR
U16 = HyTechDevices:LTC3639: LTC3639 Datasheet <https://www.mouser.com/datasheet/2/609/3639fd-1271210.pdf>; DKPN: LTC3639EMSE#TRPBFTR-ND; MANUFACTURER: Analog Devices Inc.; MOPN: 584-LTC3639EMSETRPBF; MPN: LTC3639EMSE#TRPBF
U17 = HyTechDevices:VOLTAGE_REGULATOR_ADJ_*_?: Adjustable voltage regulators. LR8 Datasheet <https://ww1.microchip.com/downloads/en/DeviceDoc/20005399B.pdf>; DKPN: LR8K4-GTR-ND; MANUFACTURER: Microchip Technology; MOPN: 689-LR8K4-G; MPN: LR8K4-G
U18 U19 = HyTechDevices:ISO224*: ISO224*: Isolated precision amplifier ISO224A: Low-Grade ISO224B: High-Grade ISO224* Datasheet <https://www.ti.com/lit/ds/symlink/iso224.pdf?HQS=dis-dk-null-digikeymode-dsf-pf-null-wwe&ts=1625423566252&ref_url=https%253A%252F%252Fwww.ti.com%252Fgeneral%252Fdocs%252Fsuppproductinfo.tsp%253FdistId%253D10%2526gotoUrl%253Dhttps%253A%252F%252Fwww.ti.com%252Flit%252Fgpn%252Fiso224>; DKPN: 296-52316-1-ND; MANUFACTURER: Texas Instruments; MOPN: 595-ISO224BDWVR; MPN: ISO224BDWVR
U$1 = HyTechDevicesTempTSB:RELAY_SOLIDSTATE_NO_?: Normally Open Solid-State Relay Datasheet <file:///C:/Users/kamin/Downloads/semi_eng_ge1a_aqy21_e.pdf>; DKPN: 255-1436-5-ND; MANUFACTURER: Panasonic Inustrial Devices; MOPN: 769-AQY214EHA; MPN: AQY214EHA
U$31 = HyTechDevices:CONNECTOR-5_?_*; MANUFACTURER: Molex; MPN: 2165713006
U$33 = HyTechDevices:CONNECTOR-5_?_*; MANUFACTURER: Molex; MPN: 2165713007

## Board
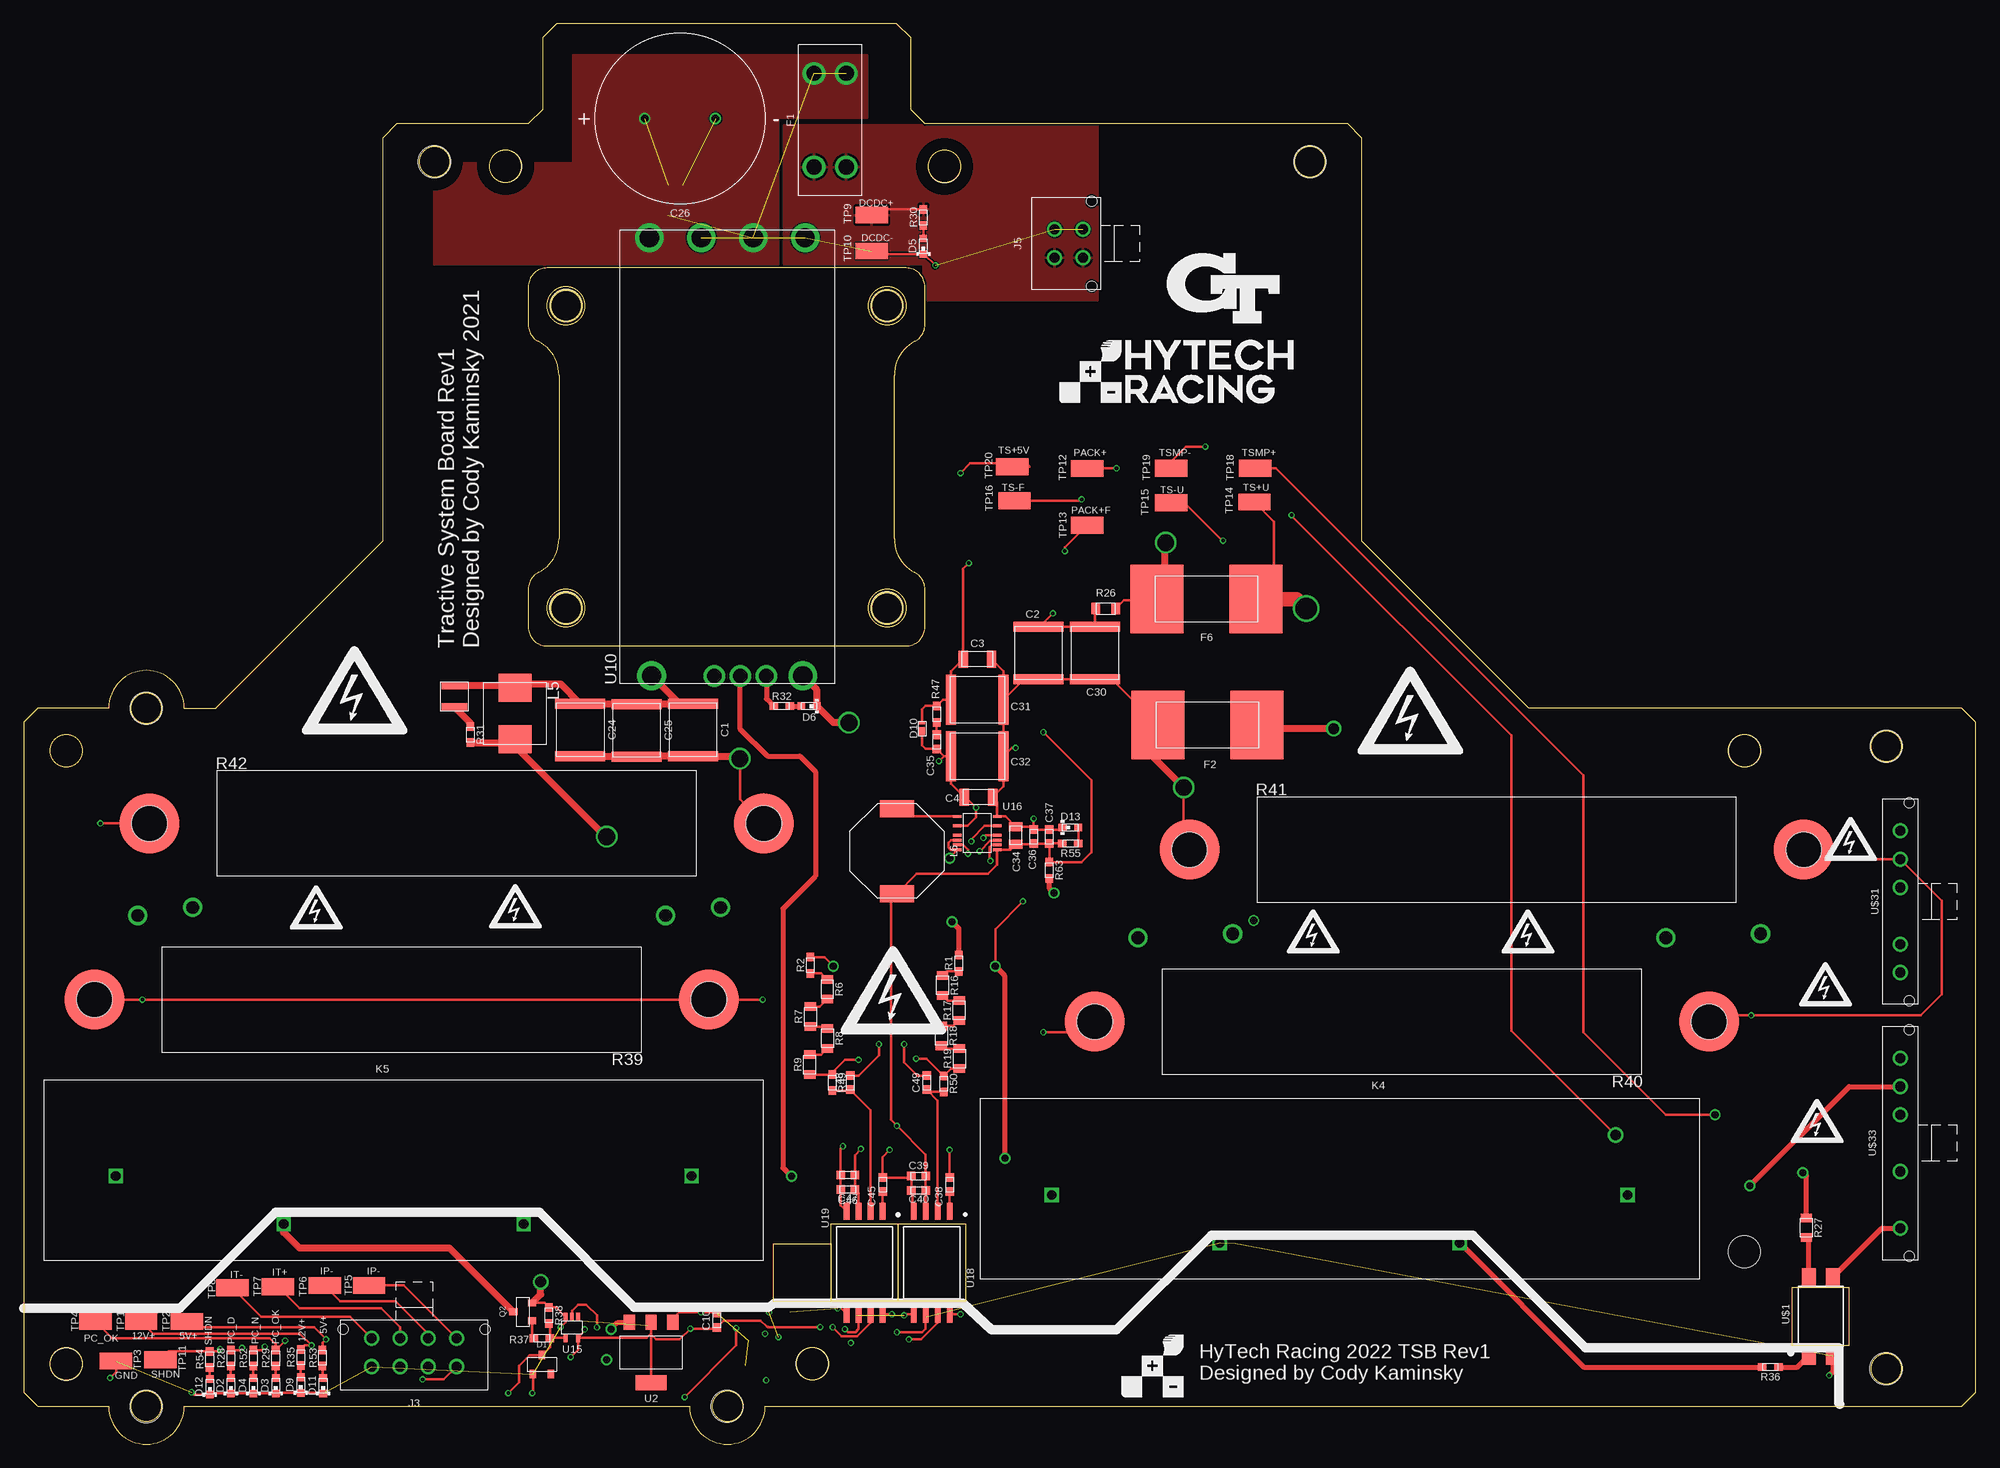
[diagram p3: board, top side]
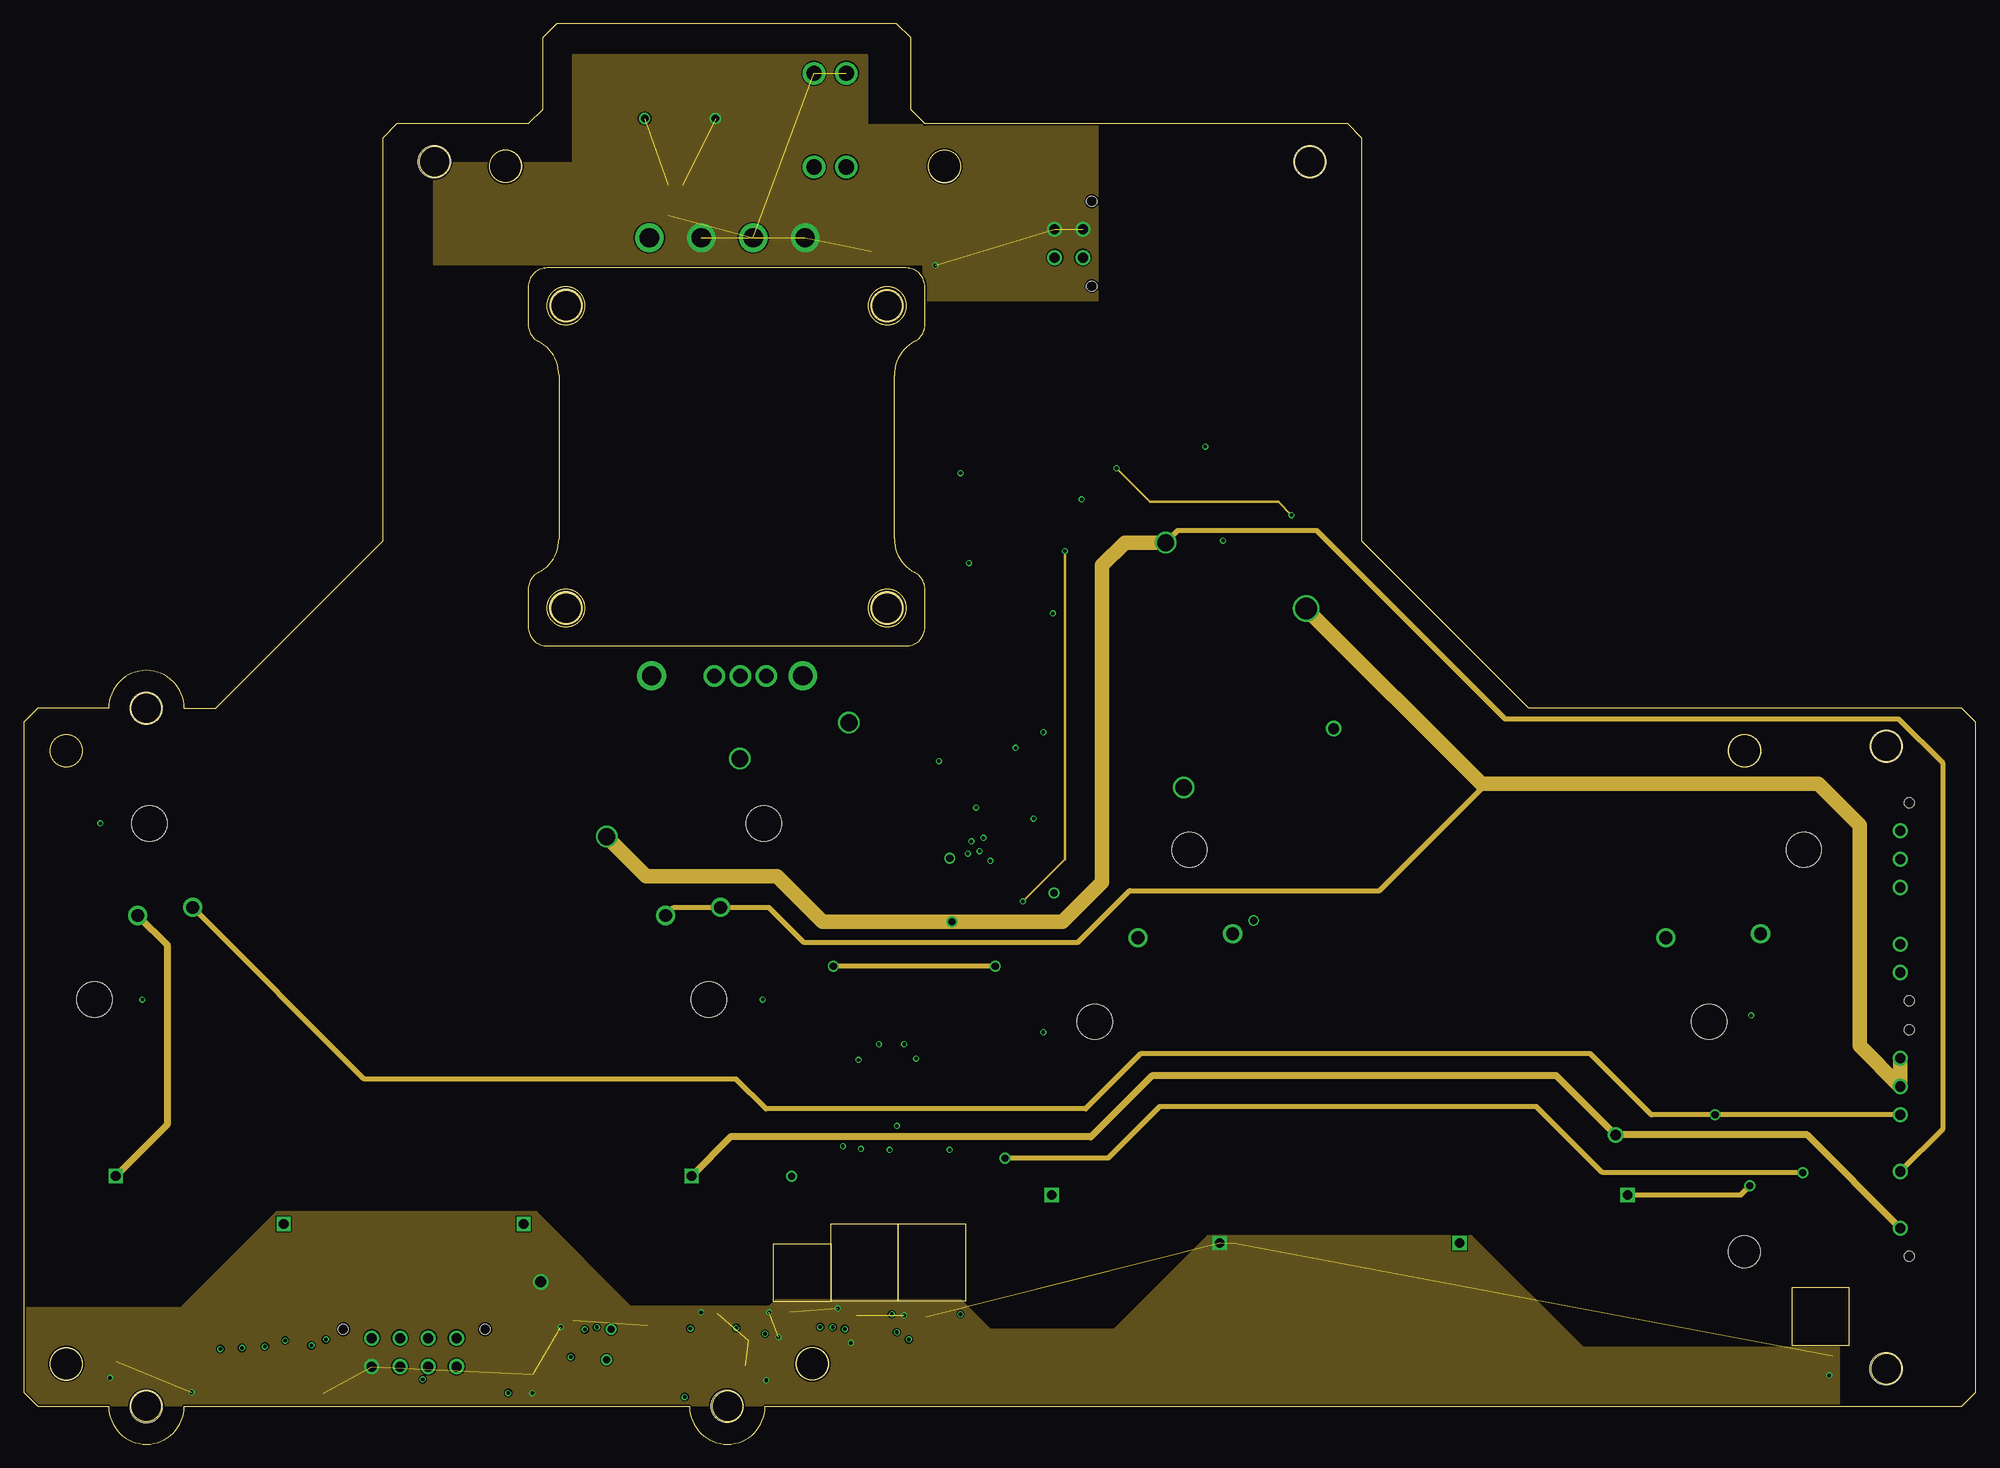
[diagram p4: board, inner layer Route2]
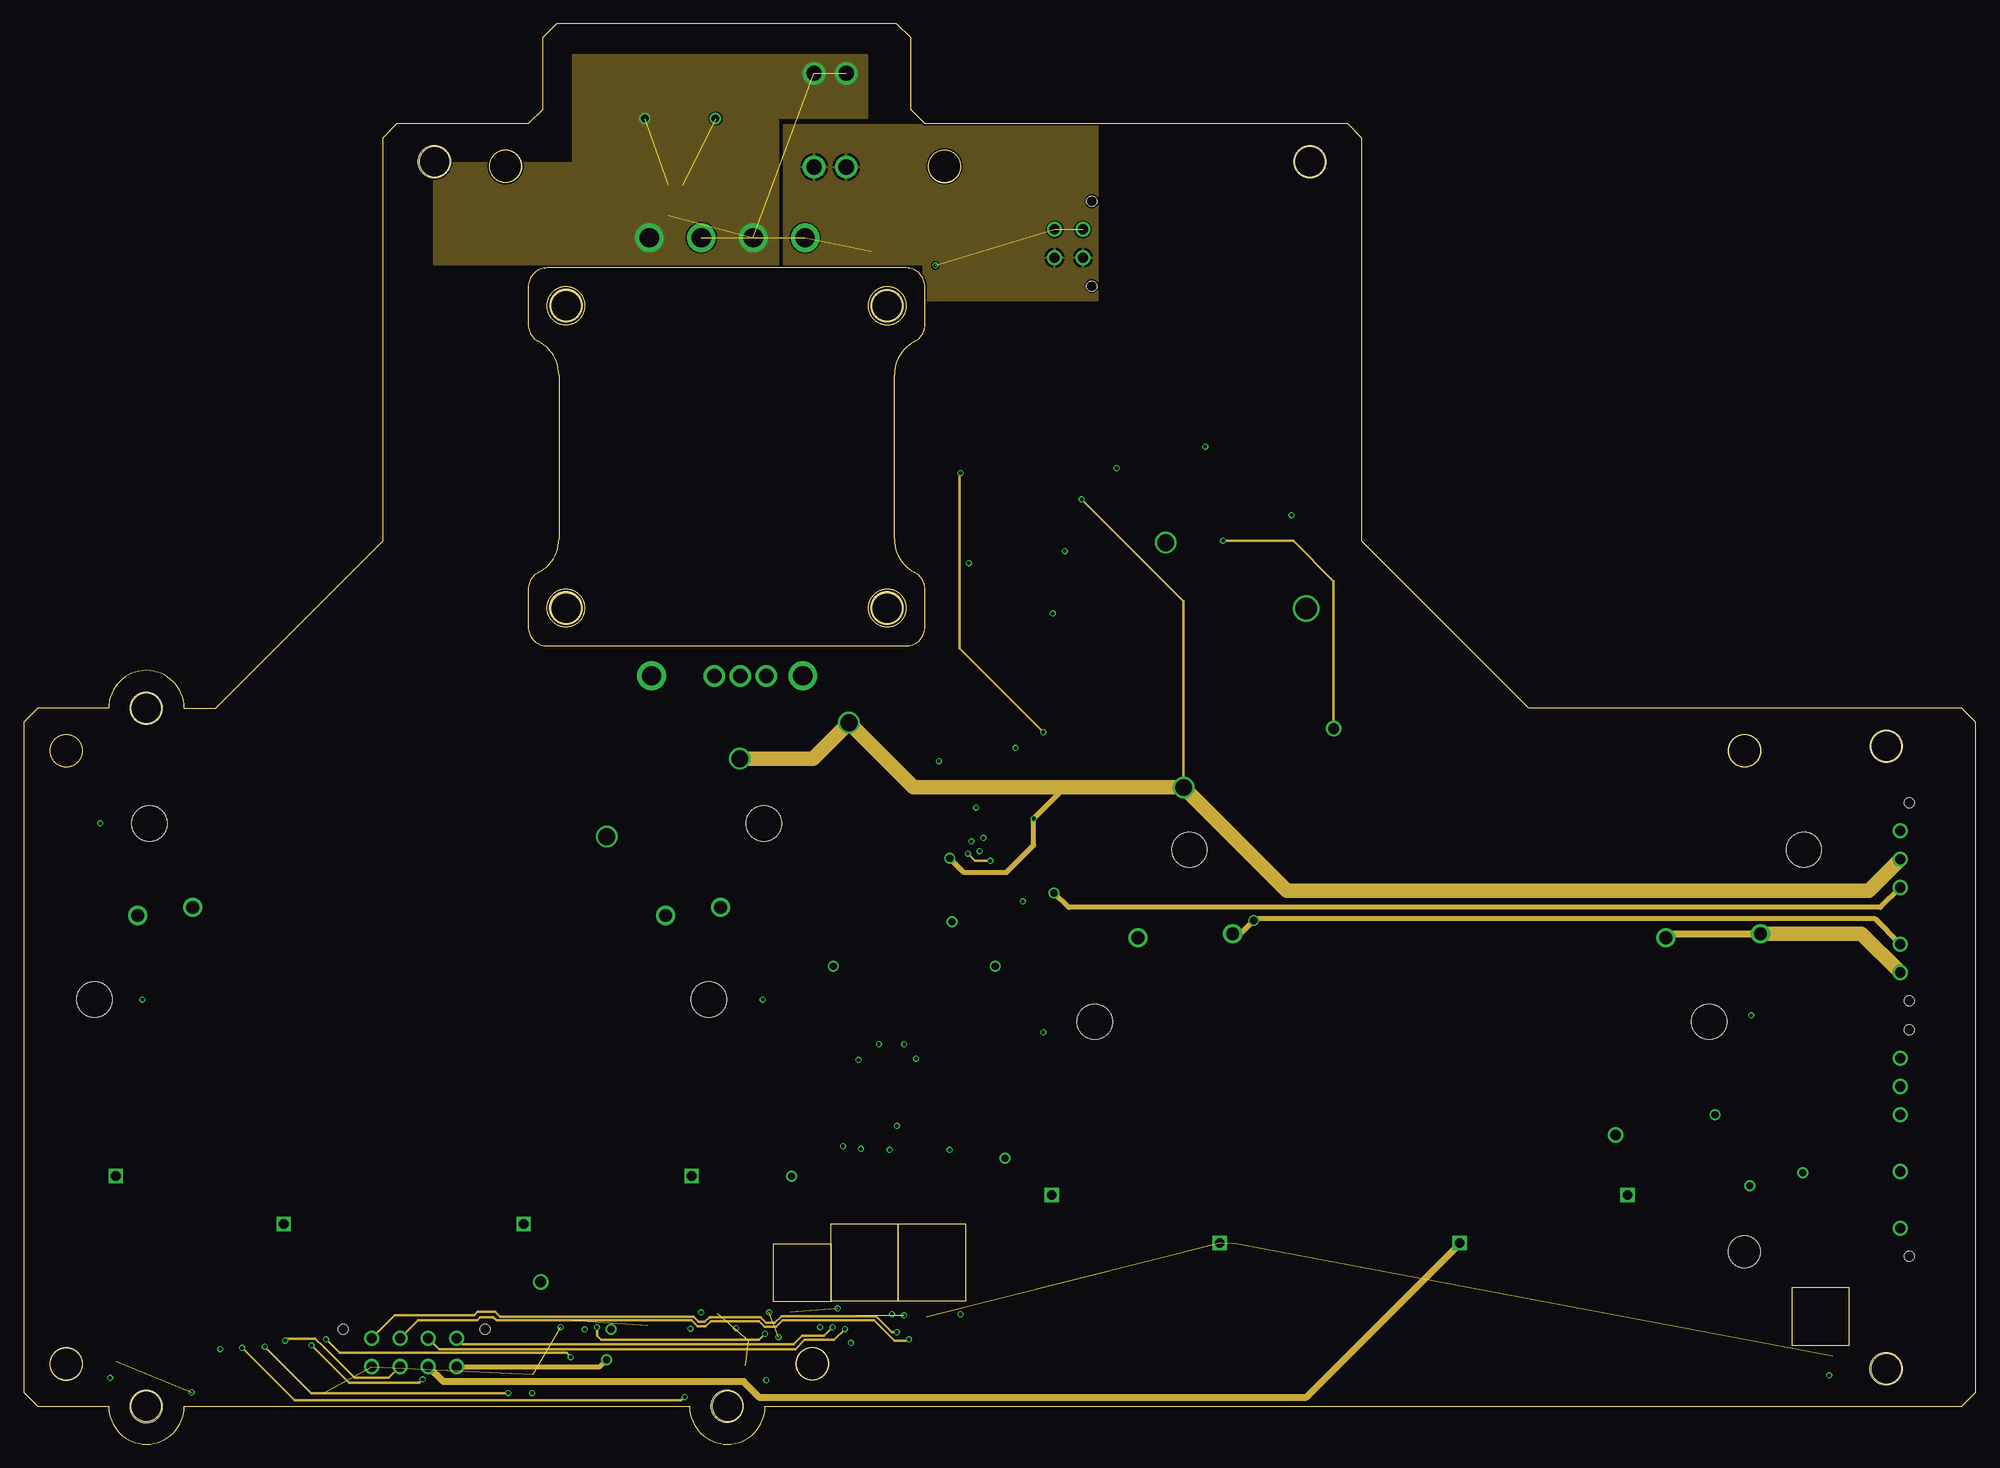
[diagram p5: board, inner layer Route15]
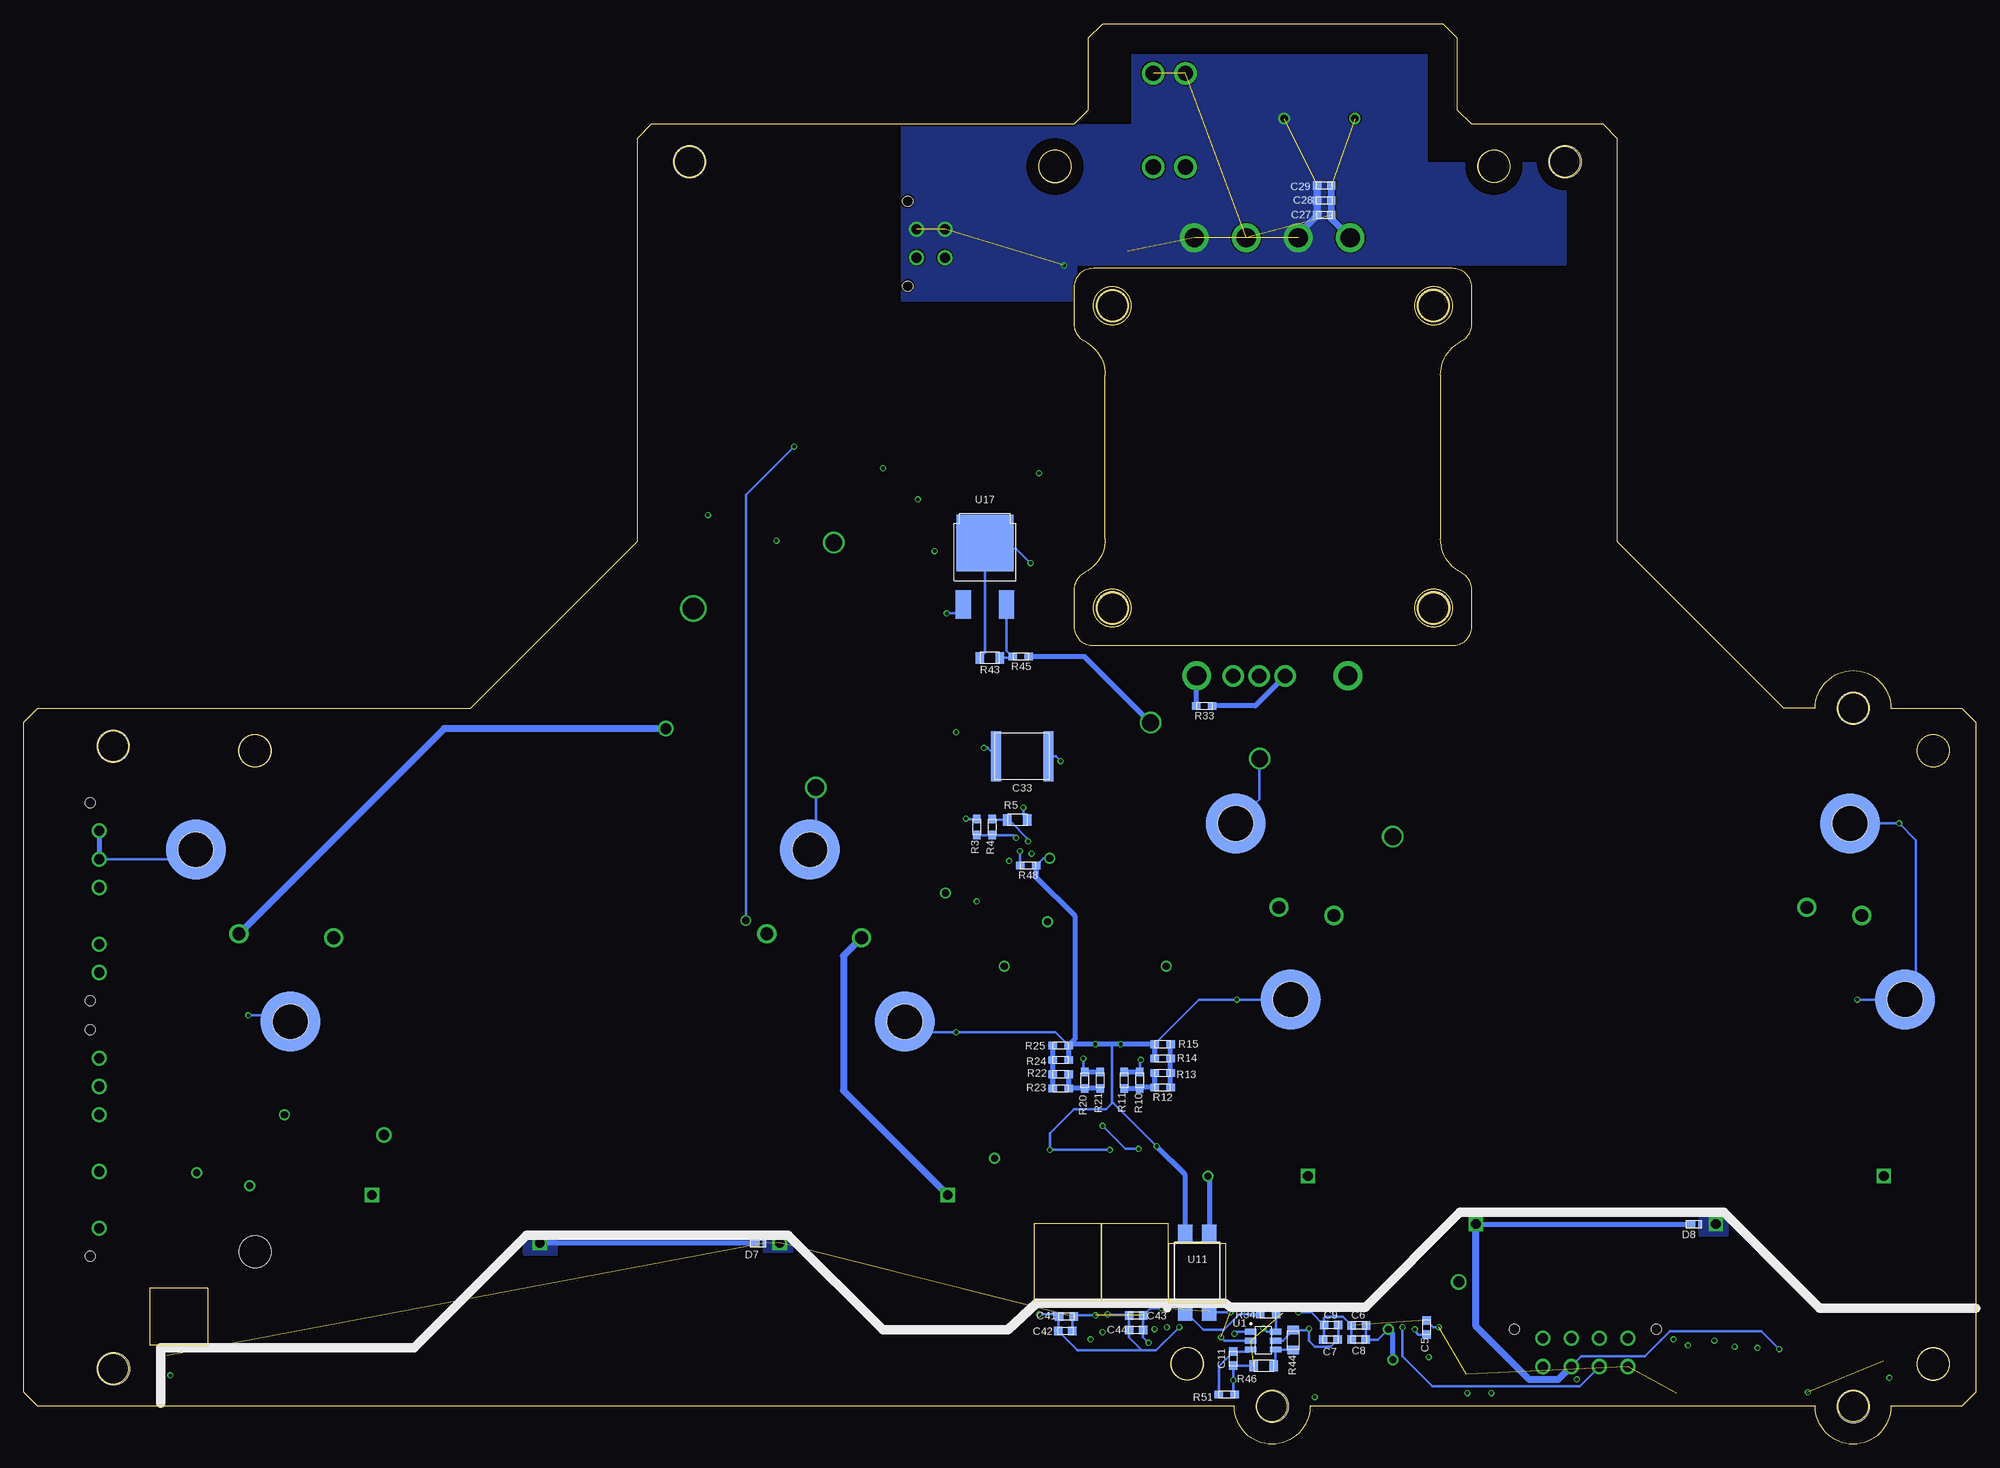
[diagram p6: board, bottom side, seen from below]

Size 206.67 x 150.35 mm. Coordinates in mm from the lower left corner, seen from the top.
Outline: 0,76.39 0,5.5 1.5,4 9,4 arc180 17,4 70.5,4 arc180 78.5,4 205.17,4 206.67,5.5 206.67,76.39 205.17,77.89 159.35,77.89 141.67,95.57 141.67,138.24 140.17,139.74 95.42,139.74 93.92,141.24 93.92,148.85 92.42,150.35 56.42,150.35 54.92,148.85 54.92,141.24 53.42,139.74 39.5,139.74 38,138.24 38,95.57 20.32,77.89 17,77.89 arc180 9,77.89 1.5,77.89 0,76.39
Outline: 92.17,95.82 92.17,113.15 arc-63 94.34,116.71 arc63 95.42,118.49 95.42,122.49 arc90 93.42,124.49 55.42,124.49 arc90 53.42,122.49 53.42,118.49 arc63 54.5,116.71 arc-63 56.67,113.15 56.67,95.82 arc-63 54.5,92.26 arc63 53.42,90.49 53.42,86.49 arc90 55.42,84.49 93.42,84.49 arc90 95.42,86.49 95.42,90.49 arc63 94.34,92.26 arc-63 92.17,95.82
Outline: circle at 4.5,73.39 radius 1.7
Outline: circle at 4.5,8.5 radius 1.7
Outline: circle at 83.5,8.5 radius 1.7
Outline: circle at 182.17,73.39 radius 1.7
Outline: circle at 51,135.24 radius 1.7
Outline: circle at 97.5,135.24 radius 1.7
Outline: circle at 136.17,135.74 radius 1.6
Outline: circle at 197.17,73.89 radius 1.6
Outline: circle at 197.17,8 radius 1.6
Outline: circle at 13,4 radius 1.6
Outline: circle at 13,77.89 radius 1.6
Outline: circle at 43.5,135.74 radius 1.6
Outline: circle at 91.42,120.49 radius 1.6
Outline: circle at 91.42,88.49 radius 1.6
Outline: circle at 57.42,88.49 radius 1.6
Outline: circle at 57.42,120.49 radius 1.6
Outline: circle at 74.5,4 radius 1.6
Outline: circle at 91.42,120.49 radius 1.7
Outline: circle at 57.42,120.49 radius 1.7
Outline: circle at 91.42,88.49 radius 1.7
Copper layers (1+2*15+16): Top 0.035mm / dielectric 0.2mm / Route2 0.0175mm / dielectric 1.065mm / Route15 0.0175mm / dielectric 0.2mm / Bottom 0.035mm
Design rules "JLCPCB (4 Layer)": minimum track width 5mil, minimum drill 0.2mm, track to track 5mil, track to pad 5mil, pad to pad 5mil, via to via 20mil, smd to smd 5mil, copper to edge 0.2mm, drill to drill 21mil, minimum pad ring 6mil, minimum via ring 5mil, stop-mask expansion 2mil, vias tented up to drill 30mil, thermal gap 10mil

### Footprints (pad centres in the part's own frame; a part is rotated, then mirrored left to right if it is on the bottom)
2220-CAP = smd 1.05 x 5.3: 1 -2.775,0; 2 2.775,0
1206-CAP = smd 1 x 1.8: 1 -1.5,0; 2 1.5,0
0603-CAP = smd 0.9 x 0.9: 1 -0.75,0; 2 0.75,0
EKYC*MM = drill 0.8: + 3.75,0; - -3.75,0
0805-CAP = smd 0.95 x 1.4: 1 -0.925,0; 2 0.925,0
SOT-23 = smd 0.711 x 0.889: 1 -0.94,-1.003; 2 0.94,-1.003; 3 0,1.003
0603-LED = smd 0.8 x 0.8: 1 -0.825,0; 2 0.825,0
CLP1608-2L = smd 0.88 x 0.62: 1 -0.295,0 | smd 0.28 x 0.62: 2 0.595,0
MINI-BLADE_FUSE_HOLDER = drill 1.6: L1 -4.953,1.702; L2 -4.953,-1.702; R1 4.953,1.702; R2 4.953,-1.702
0885 = smd 5.6 x 7.23: 1 -5.25,0; 2 5.25,0
MOLEX_MICROFIT_PTH_VERTICAL_08_DUAL = drill 1.067: 1 4.496,-2.997; 2 1.499,-2.997; 3 -1.499,-2.997; 4 -4.496,-2.997; 5 4.496,0; 6 1.499,0; 7 -1.499,0; 8 -4.496,0 | hole 1.067: 7.493,0.94; -7.493,0.94
MOLEX_MICROFIT_PTH_VERTICAL_04_DUAL = drill 1.067: 1 1.499,-2.997; 2 -1.499,-2.997; 3 1.499,0; 4 -1.499,0 | hole 1.067: 4.496,0.94; -4.496,0.94
335X = drill 1.016 square: 1 68.58,-10.16; 2 50.8,-15.24; 3 25.4,-15.24; 4 7.62,-10.16
PA4334 = smd 0.8 x 2.7: 1 -1.15,0; 2 1.15,0
WE-LMHI = smd 2.95 x 3.5: 1 -2.725,0; 2 2.725,0
SRU1048 = smd 1.8 x 3.6: 1 -4.5,0; 2 4.5,0
0603-RES = smd 0.9 x 0.8: 1 -0.85,0; 2 0.85,0
0805-RES = smd 0.9 x 1.2: 1 -1.05,0; 2 1.05,0
B20 = drill 1.35: 1 27.94,-8.89; 2 -27.94,-8.89 | smd 6.35 x 6.35: 3 -32.51,0; 5 32.51,0 | smd 6.35 x 6.35 bottom: 4 -32.51,0; 6 32.51,0 | hole 3.74: -32.51,0; 32.51,0
MICRO_MINIATURE = smd 3.429 x 1.778: 1 0,0
SOT-23-6 = smd 0.62 x 1.22: 1 -0.95,-1.31; 2 0,-1.31; 3 0.95,-1.31; 4 -0.95,1.31; 5 0,1.31; 6 0.95,1.31
SOT223 = smd 1.2 x 1.6: 1 -2.3,-3.2; 2 0,-3.2; 3 2.3,-3.2 | smd 3.3 x 1.6: 4 0,3.2
DCM4623 = drill 2.03 pad 2.79: 1 -23.19,8; 5 -23.19,-8; 6 23.19,8.25; 7 23.19,2.75; 8 23.19,-2.75; 9 23.19,-8.25 | drill 1.52 pad 2.02: 2 -23.19,1.38; 3 -23.19,-1.38; 4 -23.19,-4.13
DIP-4_AIRGAP = smd 1.5 x 1.9: 1 -1.27,-4.15; 2 1.27,-4.15; 3 -1.27,4.15; 4 1.27,4.15
SC-70-5 = smd 0.4 x 0.9: 1 -0.65,-1.1; 2 0,-1.1; 3 0.65,-1.1; 4 0.65,1.1; 5 -0.65,1.1
MSE16(12) = smd 0.309 x 0.902: 1 -1.75,-2.102; 3 -0.75,-2.102; 5 0.25,-2.102; 6 0.75,-2.102; 7 1.25,-2.102; 8 1.75,-2.102; 9 1.75,2.102; 10 1.25,2.102; 11 0.75,2.102; 12 0.25,2.102; 14 -0.75,2.102; 16 -1.75,2.102
DPAK(2-7K1S) = smd 1.6 x 3: 1 -2.3,-3.5; 3 2.3,-3.5 | smd 6 x 6: 2 0,3
SOIC-08(WIDE,0.295")-AIRGAP = smd 0.6 x 1.8: 1 -1.905,-5.45; 2 -0.635,-5.45; 3 0.635,-5.45; 4 1.905,-5.45; 5 1.905,5.45; 6 0.635,5.45; 7 -0.635,5.45; 8 -1.905,5.45
MOUNTING_M3 = hole 3.4: 0,0
MOLEX_MICROFIT_PTH_VERTICAL_06_SINGLE_SPACED = drill 1.067: 1 -7.493,0; 2 -4.496,0; 3 -1.499,0; 4 4.496,0; 5 7.493,0 | hole 1.067: 10.49,0.94; -10.49,0.94
MOLEX_MICROFIT_PTH_VERTICAL_07_SINGLE_SPACED = drill 1.067: 1 -8.992,0; 2 -5.994,0; 3 -2.997,0; 4 2.997,0; 5 8.992,0 | hole 1.067: 11.989,0.94; -11.989,0.94

### Placement (x,y rotation side)
C1  70.87,75.61 270 top
C2  107.44,83.73 270 top
C3  100.96,83.1 0 top
C4  101.09,68.49 0 top
C5  58.17,12.36 90 bottom
C6  65.32,12.59 180 bottom
C7  68.33,11.09 180 bottom
C8  65.34,11.06 180 bottom
C9  68.26,12.6 180 bottom
C10  73.41,13.12 90 top
C11  78.61,9.06 270 bottom
C24  58.93,75.61 270 top
C25  64.89,75.55 270 top
C26  69.49,140.3 180 top
C27  68.98,130.09 0 bottom
C28  68.99,131.64 0 bottom
C29  68.99,133.23 0 bottom
C30  113.41,83.73 270 top
C31  100.96,78.78 0 top
C32  100.96,72.81 0 top
C33  100.96,72.81 180 bottom
C34  105.03,64.43 90 top
C35  96.65,74.34 90 top
C36  106.93,64.3 90 top
C37  108.58,64.3 90 top
C38  98.04,27.47 90 top
C39  94.74,26.84 180 top
C40  94.74,28.36 180 top
C41  96.27,13.5 0 bottom
C42  96.39,11.98 0 bottom
C43  88.9,13.63 0 bottom
C44  88.9,12.11 0 bottom
C45  90.93,27.47 90 top
C46  87.25,26.97 180 top
C47  87.25,28.49 180 top
C48  87.5,38.27 90 top
C49  95.63,38.27 90 top
D1  54.86,8.42 0 top
D2  21.96,6.2 90 top
D3  26.7,6.2 90 top
D4  24.33,6.2 90 top
D5  95.25,126.79 90 top
D6  83.15,78.11 180 top
D7  128.9,21.25 0 bottom
D8  29.84,23.28 0 bottom
D9  29.34,6.26 90 top
D10  95.12,75.73 90 top
D11  31.71,6.2 90 top
D12  19.71,6.07 90 top
D13  110.8,65.26 0 top
F1  85.39,140.12 90 top
F2  125.33,76.12 180 top
F6  125.22,89.45 180 top
J3  41.35,11.22 0 top
J5  112.13,127.07 270 top
K4  101.23,36.55 0 top
K5  2.13,38.55 0 top
L4  45.62,79.15 270 top
L5  52.02,77.34 270 top
L6  92.46,62.78 270 top
Q2  52.83,14.01 90 top
R1  98.97,50.9 90 top
R2  83.29,50.69 90 top
R3  105.79,65.32 270 bottom
R4  104.14,65.32 90 bottom
R5  101.47,66.08 0 bottom
R6  85.07,48.14 270 top
R7  83.29,45.25 90 top
R8  85.09,42.94 270 top
R9  83.21,40.17 90 top
R10  88.52,38.52 90 bottom
R11  90.17,38.52 90 bottom
R12  86.11,37.76 180 bottom
R13  86.11,39.28 180 bottom
R14  86.11,40.81 0 bottom
R15  86.11,42.33 0 bottom
R16  97.28,48.56 270 top
R17  99.04,45.91 90 top
R18  97.15,43.22 270 top
R19  99.06,40.81 90 top
R20  94.36,38.52 90 bottom
R21  92.71,38.52 90 bottom
R22  96.9,39.16 0 bottom
R23  96.9,37.63 0 bottom
R24  96.9,40.68 180 bottom
R25  96.9,42.21 180 bottom
R26  114.55,88.43 180 top
R27  188.72,22.9 270 top
R28  21.94,9.12 90 top
R29  26.68,9.11 90 top
R30  95.25,129.84 90 top
R31  47.31,75.1 270 top
R32  80.25,78.12 0 top
R33  81.68,78.13 180 bottom
R34  74.93,13.76 180 bottom
R35  29.34,9.19 90 top
R36  184.91,8.17 180 top
R37  54.86,11.22 180 top
R38  55.63,13.63 270 top
R39  40.02,47.06 180 top
R40  145.91,44.72 180 top
R41  155.94,62.92 0 top
R42  45.85,65.7 0 top
R43  104.39,83.23 180 bottom
R44  72.26,11.02 90 bottom
R45  101.09,83.35 180 bottom
R46  75.38,8.31 0 bottom
R47  96.65,77.26 270 top
R48  100.33,61.26 180 bottom
R49  85.6,38.27 270 top
R50  97.41,38.14 270 top
R51  79.31,5.26 180 bottom
R52  24.31,9.11 90 top
R53  31.64,9.13 270 top
R54  19.7,8.98 90 top
R55  110.81,63.58 180 top
R63  108.58,60.75 270 top
TP1  12.45,13 0 top
TP2  17.27,13 0 top
TP3  9.78,8.8 0 top
TP4  7.62,13 0 top
TP5  36.58,16.81 0 top
TP6  31.88,16.81 0 top
TP7  26.92,16.68 0 top
TP8  22.1,16.55 0 top
TP9  89.79,130.09 0 top
TP10  89.79,126.28 0 top
TP11  14.48,8.93 0 top
TP12  112.58,103.26 0 top
TP13  112.58,97.27 0 top
TP14  130.3,99.73 0 top
TP15  121.47,99.63 0 top
TP16  104.9,99.86 0 top
TP18  130.36,103.31 0 top
TP19  121.47,103.28 0 top
TP20  104.65,103.46 0 top
U1  75.45,10.97 270 bottom
U2  66.42,9.69 180 top
U10  74.49,104.51 90 top
U11  82.43,18.15 0 bottom
U15  58.04,12.36 180 top
U16  100.96,64.68 270 top
U17  104.9,92.37 0 bottom
U18  96.14,19.23 180 top
U19  89.03,19.22 180 top
U$1  190.25,13.5 0 top
U$5  [MOUNTING_M3]  12.98,3.99 0 top
U$6  [MOUNTING_M3]  12.99,77.91 0 top
U$7  [MOUNTING_M3]  74.48,4 0 top
U$8  [MOUNTING_M3]  197.16,7.98 0 top
U$9  [MOUNTING_M3]  197.17,73.88 0 top
U$10  [MOUNTING_M3]  43.49,135.74 0 top
U$11  [MOUNTING_M3]  136.15,135.74 0 top
U$12  [MOUNTING_M3]  57.45,120.51 0 top
U$13  [MOUNTING_M3]  91.42,120.49 0 top
U$14  [MOUNTING_M3]  57.4,88.51 0 top
U$15  [MOUNTING_M3]  91.42,88.53 0 top
U$26  [MOUNTING_M3]  182.17,20.37 0 top
U$31  198.67,57.42 270 top
U$33  198.66,31.86 270 top
U$34  [MOUNTING_M3]  4.52,8.48 0 top
U$35  [MOUNTING_M3]  83.47,8.52 0 top
U$37  [MOUNTING_M3]  4.51,73.4 0 top
U$38  [MOUNTING_M3]  182.19,73.39 0 top
U$39  [MOUNTING_M3]  97.5,135.23 0 top
U$41  [MOUNTING_M3]  51.02,135.25 0 top
U$43  [HV_0.50"]  193.42,64.05 0 top
U$44  [HV_0.50"]  190.75,48.68 0 top
U$45  [HV_0.50"]  189.86,34.2 0 top
U$46  [HV_0.50"]  136.52,54.27 0 top
U$47  [HV_0.50"]  159.26,54.27 0 top
U$48  [HV_1.00"]  92.07,48.05 0 top
U$49  [HV_0.50"]  30.99,56.81 0 top
U$50  [HV_0.50"]  52.07,56.94 0 top
U$51  [HV_1.00"]  35.05,79.8 0 top
U$52  [HV_1.00"]  146.81,77.64 0 top
U$53  [LOGO_HYTECH_1.0"]  109.35,109.9 0 top
U$54  [LOGO_GT_0.50"]  127,122.34 0 top
U$55  [LOGO_HYTECH_SQUARE_0.28"]  119.51,8.3 0 top
U$56  [GLV]  2.54,13.12 0 top
U$57  [GLV]  22.22,13.88 0 top
U$58  [GLV]  58.42,16.42 0 top
U$59  [GLV]  108.84,10.46 0 top
U$60  [GLV]  121.79,14.14 0 top
U$61  [GLV]  157.99,13.38 0 top
U$62  [GLV]  178.43,8.68 0 top
U$63  [TS]  164.59,13.5 0 top
U$64  [TS]  178.18,11.6 0 top
U$65  [TS]  116.2,15.66 0 top
U$66  [TS]  108.71,13.5 0 top
U$67  [TS]  65.28,16.55 0 top
U$68  [TS]  15.75,16.55 0 top
U$69  [TS]  2.54,16.17 0 top

### Tracks (layer width: path | path; a pad name or v marks a point on that pad's centre or on a via)
+5V  (via drill 0.38)
  Top 0.254: U15.5 65.96,11.26 66.42,11.73 U2.2 66.42,11.6 | U2.4 66.42,11.6 | 66.42,11.6 66.93,11.09 69.45,11.09 v70.59,12.23 73.26,12.23 C10.1 74.09,13.06 78.04,13.06 78.69,12.41 78.79,12.41 78.8,12.4 v84.34,12.4 | U15.5 59.41,11.98 v59.41,12.15 | R53.1 31.64,10.72 v32,11.09 30.73,12.36 17.91,12.36 TP2.1 | v57.91,9.22 58.69,10 U15.5 | v99.19,13.76 98.06,13.76 U18.8 | v91.92,13.76 91.89,13.76 91.88,13.75 90.88,13.75 90.89,13.77 U19.8
  Route15 0.254: v57.91,9.22 57.47,9.67 33.44,9.67 32.02,11.09 v32,11.09
  Bottom 0.254: U1.5 73.37,10.97 R44.2 70.75,12.07 v70.59,12.23 70.59,10.95 69.96,10.32 68.33,10.32 67.58,11.07 C7.1 67.51,11.16 C9.1 | v59.41,12.15 59.41,12 59.03,11.61 C5.1 | v99.19,13.76 97.27,13.76 C41.1 97.14,13.38 C42.1 95.08,9.92 88.26,9.92 | v91.92,13.76 91.89,13.73 89.75,13.73 C43.1 C44.1 89.65,11.31 88.26,9.92 | v84.34,12.4 86.81,9.92 88.26,9.92
+12V  (via drill 0.38, 0.76)
  Top 0.254: R35.2 29.76,10.46 v30.48,10.46 29.23,11.7 13.74,11.7 TP1.1 | v42.24,6.86 44.48,6.86 J3.1
  Top 0.508: v62.18,12.18 62.89,12.89 U2.3
  Route15 0.254: v30.48,10.46 34.45,6.48 41.86,6.48 v42.24,6.86
  Route15 0.508: J3.1 61.01,8.22 v61.72,8.93
  Bottom 0.254: C6.1 64.59,12.57 C8.1 63.3,11.06 v62.18,12.18
  Bottom 0.508: v61.72,8.93 61.72,11.72 v62.18,12.18
DCDC+
  Top 0.254: TP9.1 90.38,130.69 R30.2
  pour Top: 80.52,124.88 95.25,124.88 95.25,121.07 113.66,121.07 113.66,139.61 80.52,139.61
  pour Route15: 80.52,124.88 95.25,124.88 95.25,121.07 113.66,121.07 113.66,139.61 80.52,139.61
DCDC-  (via drill 0.38)  (5 unrouted)
  Top 0.254: TP10.1 90.11,125.96 D5.1 95.31,125.96 v96.52,124.76
  Bottom 0.762: C29.1 C28.1 C27.1 71.74,128.08 U10.7
  pour Bottom (no thermals): 43.43,135.55 43.43,124.88 95.25,124.88 95.25,121.07 113.66,121.07 113.66,139.61 89.28,139.61 89.28,146.98 58.17,146.98 58.17,135.55
  pour Route2 (no thermals): 43.43,135.55 58.17,135.55 58.17,146.98 89.28,146.98 89.28,139.61 113.66,139.61 113.66,121.07 95.25,121.07 95.25,124.88 43.43,124.88
ENABLE  (via drill 0.76)
  Top 0.508: v81.28,28.36 80.39,29.25 80.39,56.68 83.82,60.11 83.82,71.16 82.17,72.81 78.74,72.81 75.87,75.68 U10.3
  Bottom 0.508: v81.28,28.36 81.16,28.24 U11.4
GND  (via drill 0.38, 1.14)  (13 unrouted)
  Top 0.254: Q2.2 55.15,14.95 R38.1 56.37,14.48 U15.3 57.39,12.9 v56.87,12.39 | D11.1 31.64,5.44 D9.1 26.77,5.44 D3.1 D4.1 D2.1 19.84,5.37 D12.1 18.04,5.24 v17.78,5.5 | D1.1 53.92,5.49 v53.85,5.41 | TP3.1 9.78,7.66 v9.14,7.03 | v93.22,13.63 93.36,13.78 U18.5 | U2.1 68.72,13.26 69.41,13.95 v71.72,13.95 73.33,13.95 C10.2 | U19.5 86.51,14.38 v86.17,14.38
  Top 0.508: U$1.2 191.52,7.66 v191.13,7.28
  Top 0.762: Q2.2 54.74,15.85 v54.74,17.19
  Bottom 0.254: C8.2 66.09,12.57 C6.2 66.98,13.5 68.83,13.5 69.01,13.33 C9.2 | C7.2 69.01,11.16 C9.2 | v71.72,13.95 70.36,13.95 C9.2 | C5.2 57.44,12.39 v56.87,12.39 | U11.2 81.1,13.95 v78.94,13.95 | U1.2 78.31,10.97 78.31,10.96 79.53,10.96 v79.91,11.34 | C42.2 95.64,13.38 C41.2 95.39,13.63 v93.22,13.63 | v87.57,10.72 88.15,11.3 C44.2 C43.2 87.4,14.38 v86.17,14.38 | C11.2 78.61,8.04 | 78.61,8.04 v78.61,6.77 78.61,5.42 R51.1 | R46.1 78.35,8.31 78.61,8.04
  pour Route2 (no thermals): 0,5.5 0,14.39 16.64,14.39 26.8,24.55 54.18,24.55 54.18,24.55 54.29,24.55 54.29,24.53 64.26,14.55 78.94,14.55 79.63,15.25 99.23,15.25 102.38,12.11 115.44,12.11 125.35,22.01 153.29,22.01 165.1,10.2 192.15,10.2 192.15,4.11 1.4,4.11
  pour Bottom (no thermals): 128.27,21.89 128.27,20.36 125.35,20.36 125.35,21.5 125.73,21.89
IP+  (via drill 0.38)
  Top 0.254: U19.7 89.66,12.87 88.24,11.45 86.59,11.45 v85.65,12.38 | TP5.1 40.25,16.81 J3.5
  Route15 0.254: J3.5 46.49,10.57 81.52,10.57 82.42,11.47 84.74,11.47 v85.65,12.38
IP-  (via drill 0.38)
  Top 0.254: TP6.1 33.53,15.15 39.37,15.15 42.84,11.68 J3.6 | v86.94,12.18 87.25,11.87 88.05,11.87 88.39,12.2 U19.6
  Route15 0.254: J3.6 43.99,10.07 81.7,10.07 82.68,11.05 85.81,11.05 v86.94,12.18
IT+  (via drill 0.38)
  Top 0.254: v93.73,11.09 95.01,11.09 96.77,12.85 U18.7 | TP7.1 29.21,14.39 37.85,14.39 39.85,12.39 J3.7
  Route15 0.254: v93.73,11.09 93.6,10.96 92.2,10.96 90.04,13.12 80.35,13.12 79.67,12.45 78.44,12.45 77.85,13.04 72.77,13.04 72.22,12.49 71.35,12.49 70.73,13.11 50.05,13.11 49.72,13.44 48.32,13.44 48.01,13.12 41.75,13.12 J3.7
IT-  (via drill 0.38)
  Top 0.254: v92.46,11.85 95.12,11.85 95.5,12.23 U18.6 | TP8.1 25.15,13.5 34.56,13.5 J3.8
  Route15 0.254: v92.46,11.85 91.93,11.85 90.21,13.57 80.22,13.57 79.5,12.85 78.61,12.85 78.02,13.44 72.6,13.44 72.11,12.95 71.47,12.95 70.9,13.52 50.43,13.52 49.94,14.01 48.06,14.01 47.68,13.63 39.26,13.63 J3.8
LED+  (via drill 0.76)
  Top 0.508: v109.09,58.33 108.62,58.8 108.62,59.86
  Top 0.762: 108.62,59.86 R63.2
  Route15 0.508: U$31.3 196.56,56.81 110.62,56.81 v109.09,58.33
N$2  (via drill 0.38)
  Top 0.254: U16.12 101.86,64.43 v101.6,64.18
  Bottom 0.254: R3.2 R4.1 101.89,64.47 v101.6,64.18
N$3
  Top 0.254: R37.2 53.83,11.4 Q2.1
N$4
  Bottom 0.254: R44.1 74.09,9.97 U1.6 74.14,8.5 R46.2
N$5  (via drill 0.38)
  Top 0.254: v100.33,63.8 100.33,64.05 101.71,65.43 U16.14
  Bottom 0.254: R4.2 104.05,66.08 R5.1 102.36,66.08 100.33,64.05 v100.33,63.8
N$6
  Bottom 0.254: R34.2 77.94,13.76 79.59,12.11 81.79,12.11 83.68,14 U11.1
N$7
  Top 0.254: R7.2 84.28,46.3 R6.2
N$8
  Top 0.254: R7.1 84.88,44.2 R8.1
N$9
  Top 0.254: R16.1 97.73,50.05 R1.1
N$10
  Top 0.254: R2.1 84.43,49.84 R6.1
N$11
  Top 0.254: R8.2 84.42,41.22 R9.2
N$12
  Bottom 0.508: R20.1 R21.1 96.01,37.67 R23.2 R22.2
N$13  (via drill 0.38)
  Top 0.254: R49.1 R9.1 85.4,39.12 | v88.39,40.68 86.96,40.68 85.49,39.21 | 85.49,39.21 85.4,39.12 | 85.4,39.12 85.49,39.21
  Bottom 0.254: v88.39,40.68 88.52,40.55 R10.2
  Bottom 0.508: R10.2 R11.2
N$14
  Bottom 0.254: R51.2 80.16,8.26 C11.1 76.97,9.81 U1.3
N$15  (via drill 0.38)
  Top 0.254: v108.97,87.93 107.55,86.51 C2.1 112.65,86.51 112.75,86.61 113.31,86.61 C30.1 113.41,88.34 R26.2
  Bottom 0.254: U17.1 108.15,87.93 v108.98,87.93 109.03,87.98 109.02,87.98 v108.97,87.93
N$16  (via drill 0.38)
  Top 0.254: R28.2 22.88,9.97 v23.11,10.2 | v69.98,4.99 75.44,10.46 v75.44,12.29
  Route15 0.254: v23.11,10.2 28.68,4.64 69.62,4.64 v69.98,4.99
  Bottom 0.254: R34.1 74.08,11.98 U1.4 75.07,11.92 v75.44,12.29
N$17
  Top 0.254: R28.1 21.94,7.04 D2.2
N$18
  Top 0.254: R30.1 D5.2
N$19
  Top 0.254: R16.2 97.83,46.96 R17.2
N$20
  Top 0.254: R17.1 98.45,44.27 R18.1
N$21
  Top 0.254: R18.2 97.47,41.86 R19.2
N$22
  Top 0.254: R29.1 26.68,7.04 D3.2
N$23  (via drill 0.38)
  Top 0.254: R19.1 98.18,39.76 R50.1 95.59,40.81 v94.49,40.81
  Bottom 0.254: v94.49,40.81 94.49,39.5 R20.2
  Bottom 0.508: R21.2 R20.2
N$24
  Top 0.254: R52.1 24.31,7.04 D4.2
N$25
  Top 0.254: R35.1 D9.2
N$29
  Top 0.762: L4.2 47.31,76.31 R31.1
N$30
  Top 0.254: R53.2 31.64,7.09 D11.2
N$31
  Top 0.254: R54.1 19.7,6.91 D12.2
N$32
  Bottom 0.508: R12.1 R13.1 R14.2 R15.2
N$33
  Bottom 0.508: R23.1 R22.1 R24.2 R25.2
N$34
  Bottom 0.508: R11.1 R10.1 88.43,37.76 R12.2 R13.2
N$35
  Top 0.254: R55.1 111.66,65.23 D13.2
N$39
  Top 0.762: U10.1 69.43,78.38 C1.1 70.81,78.33 C25.1 58.98,78.33 C24.1 56.88,80.43 52.39,80.43 L5.1 51.79,80.3 L4.1
N$40
  Top 0.762: Q2.3 45.1,20.74 29.21,20.74 27.53,22.42 K5.3
  pour Bottom (no thermals): 29.21,24.43 29.21,22.14 26.29,22.14 26.29,23.79 26.92,24.43
N$43
  Top 0.508: R32.2 81.11,78.11 D6.2
N$44
  Top 0.508: U10.4 78.64,81.3 78.64,78.88 R32.1
N$45
  Bottom 0.508: U10.2 76.29,78.13 R33.1
N$46  (4 unrouted)
  Bottom 0.762: U10.6 68.24,129.7 C27.2 | C27.2 | C27.2 C28.2 C29.2
  pour Top (no thermals): 43.43,124.88 43.43,135.55 58.17,135.55 58.17,146.98 89.28,146.98 89.28,140.38 80.52,140.38 79.88,140.38 79.88,124.88
  pour Route15 (no thermals): 43.43,135.55 58.17,135.55 58.17,146.98 89.28,146.98 89.28,140.38 79.88,140.38 79.88,124.88 43.43,124.88
N$50
  Route2 0.762: R39.1 15.24,52.8 15.24,33.88 K5.4
N$51
  Bottom 0.762: K4.4 119.89,37.43 119.89,51.69 R40.1
N$52  (via drill 0.38)
  Top 0.254: R37.1 55.71,10.28 D1.3 53.58,9.43 52.45,8.3 52.45,6.56 v51.31,5.41 | R37.1 55.71,12.69 R38.2 | R37.1 55.76,11.26 U15.4 | R52.2 25.16,9.96 v25.53,10.33
  Route15 0.254: v25.53,10.33 30.44,5.41 v51.31,5.41
N$53
  Top 0.508: R36.1 187.79,8.17 U$1.1
N$54
  Bottom 0.254: R43.1 102.07,83.23 101.96,83.33 | R45.2 101.96,83.33 | U17.3 102.6,83.97 101.96,83.33
N$57
  Top 0.254: 188.98,21.6 R27.2
  Top 0.508: U$1.3 188.98,21.6
N$58  (via drill 0.38)
  Top 0.254: D10.2 95.12,77.77 95.5,78.15 96.61,78.15 R47.1 97.32,78.78 C31.1 98.19,81.82 C3.1 99.46,92.65 v100.08,93.26
  Bottom 0.254: U17.2 104.9,94.78 | 104.9,94.78 104.9,83.77 R43.2 | v100.08,93.26 101.6,94.78 104.9,94.78
N$60
  Top 0.254: R47.2 C35.2
N$61  (via drill 0.38)
  Top 0.254: U16.3 99.94,65.43 100.84,66.34 v100.84,67.38 99.72,68.49 C4.1 98.19,69.9 C32.1 97.42,72.81 | 97.42,72.81 C35.1 95.49,73.59 95.12,73.96 D10.1 | 97.42,72.81 96.91,72.3 v96.9,72.3
  Bottom 0.254: v100.84,67.38 100.84,66.5 R5.2 | v96.9,72.3 97.41,72.81 C32.1
N$62
  Top 0.254: R49.2 87.4,37.42 C48.1 89.66,35.36 U19.2
N$63
  Top 0.254: R50.2 95.86,37.29 C49.1 96.77,36.38 U18.2
N$64  (via drill 0.38)
  Top 0.254: U16.11 103,63.87 102.31,63.87 v101.23,62.78 v101.22,62.78
  Bottom 0.254: R48.2 101.18,62.74 v101.22,62.78
N$65
  Top 0.254: L6.1 93.3,66.43 U16.1
N$69
  Top 0.254: C45.1 U19.1
N$73
  Top 0.254: U18.1 C38.1
N$76  (via drill 0.38)
  Top 0.254: U16.7 99.42,63.43 99.95,62.91 v99.95,62.5 | v102.33,61.73 102.23,61.82 102.23,63.16 102.51,63.43 U16.10
  Route15 0.254: v99.95,62.5 100.72,61.73 v102.33,61.73
PACK+  (via drill 0.38, 1.14)
  Top 0.254: v168.53,32.73 157.48,43.78 157.48,75.02 134.24,98.26 v134.24,98.34 | v115.7,103.29 112.61,103.29 TP12.1
  Top 0.508: U$1.4 196.73,22.87 U$33.5
  Route2 0.254: v134.24,98.34 132.82,99.76 119.23,99.76 v115.7,103.29
  Route2 0.762: U$33.5 188.8,32.73 v168.53,32.73 162.23,39.03 119.51,39.03 112.99,32.52 74.84,32.52 K5.1
PACK+FUSED  (via drill 0.38, 0.76)
  Top 0.254: v102.87,50.59 102.87,54.52 v105.79,57.45 | v110.24,94.53 110.24,94.92 TP13.1 | R2.2 84.77,51.54 v85.72,50.59
  Top 0.508: R27.1 188.72,28.36 v188.34,28.74 | v103.89,30.27 103.89,49.57 v102.87,50.59
  Route2 0.254: v105.79,57.45 110.24,61.89 v110.24,94.53
  Route2 0.508: v102.87,50.59 v85.72,50.59 | v188.34,28.74 167.13,28.74 160.15,35.73 120.27,35.73 114.81,30.27 v103.89,30.27
PRECHARGE_OK  (via drill 0.38)
  Top 0.254: v60.7,12.38 60.7,13.64 59.56,14.77 58.67,14.77 58.04,14.14 U15.2 | v27.69,10.96 v27.68,10.96 R29.2 26.68,10.57 26.03,11.22 9.4,11.22 TP4.1
  Route15 0.254: v78.49,11.69 77.86,11.07 61.11,11.07 60.7,11.48 v60.7,12.38 | v27.69,10.96 27.9,11.18 30.89,11.18 31.83,10.24 31.84,10.24 35.05,7.03 38.65,7.03 J3.3
  Bottom 0.254: J3.3 41.93,6.14 57.53,6.14 60.7,9.3 v60.7,12.38 | U1.1 78.25,11.92 v78.49,11.69
SHDN  (via drill 0.38)
  Top 0.254: v20.83,10.07 20.59,9.83 R54.2 15.38,9.83 TP11.1
  Top 0.508: K4.2 165.16,8.17 R36.2
  Route15 0.762: J3.2 44.44,6.62 76.22,6.62 77.85,4.99 135.78,4.99 152.03,21.24 K4.2
  Bottom 0.254: v20.83,10.07 22.73,11.98 32.38,11.98 33.37,10.99 33.38,10.99 35.05,9.31 41.75,9.31 J3.2
  Bottom 0.508: D8.1 30.16,23.31 K5.2 | D7.1 151.97,21.25 K4.2
  Bottom 0.762: J3.2 44.24,6.82 47.29,6.82 52.93,12.46 K5.2
  pour Bottom (no thermals): 150.24,22.01 150.24,20.11 153.67,20.11 153.67,21.89
TS+5V  (via drill 0.38)
  Top 0.254: C37.1 C36.1 106.89,63.51 C34.1 104.46,62.93 U16.9 103.07,61.33 102.11,60.37 94.54,60.37 L6.2 91.82,57.64 91.82,34.33 v92.46,33.7 95.49,30.66 C40.1 C39.1 95.49,24.69 U18.3 | U19.3 88.39,26.57 C46.1 C47.1 88,30.6 v88.65,31.25 | C37.1 108.61,63.58 R55.2 | C37.1 R63.1 111.97,61.6 113.03,62.65 113.03,70.27 v107.95,75.35 | v99.19,102.78 100.2,103.8 106.17,103.8 106.51,103.46 TP20.1
  Route15 0.254: v107.95,75.35 99.06,84.24 99.06,102.66 v99.19,102.78
  Bottom 0.254: v92.46,33.7 90,31.25 v88.65,31.25
TS+FUSED  (via drill 0.76, 1.78)
  Top 0.254: 120.08,88.75 120.08,89.32 116.49,89.32 R26.1
  Top 0.508: 120.08,88.75 119.38,89.45 F6.2 | v98.3,55.29 98.97,54.61 R1.2 | F6.2 120.08,89.34 120.08,89.32 | F6.2 120.84,90.32
  Top 0.762: 120.84,90.32 120.84,95.36 v120.9,95.42 | R31.2 51.65,74.25 L5.2 52.02,73.88 61.59,64.3 v61.72,64.3
  Route2 0.508: U$33.4 203.2,33.41 203.2,72.05 198.5,76.75 156.84,76.75 136.91,96.69 122.17,96.69 v120.9,95.42
  Route2 1.524: v120.9,95.42 116.59,95.42 114.17,93.01 114.17,59.48 109.98,55.29 v98.3,55.29 84.58,55.29 79.76,60.11 65.91,60.11 v61.72,64.3
TS+UNFUSED  (via drill 0.76, 2.29)
  Top 0.254: F6.1 132.38,91.35 132.38,97.65 TP14.1
  Top 0.508: v182.75,27.35 193.26,37.86 U$33.2
  Top 1.524: v135.76,88.43 134.75,89.45 F6.1
  Route2 0.508: R39.2 68.82,56.81 R42.1 78.87,56.81 82.55,53.13 111.63,53.13 117.09,58.59 143.51,58.59 154.3,69.38 154.3,69.89 | K4.1 181.79,26.39 v182.75,27.35
  Route2 1.524: U$33.1 U$33.2 194.36,42.16 194.36,65.53 189.99,69.89 154.3,69.89 v135.76,88.43
TS-FUSED  (via drill 0.38, 0.76, 1.78)
  Top 0.254: C36.2 C37.2 109.77,65.05 D13.1 | C36.2 106.63,65.36 C34.2 103.95,66.43 U16.16 103.07,68.02 C4.2 103.74,69.64 C32.2 | v106.93,66.21 C36.2 | U16.6 98.18,63.93 97.92,63.67 97.92,63.16 98.14,62.93 U16.8 98.04,62.12 v98.04,62.02 | 119.51,76.12 F2.2 115.24,80.96 C30.2 C2.2 105.92,80.96 C31.2 | U19.4 86.49,25.3 86.49,26.95 C46.2 C47.2 86.5,31.3 v86.74,31.54 | U18.4 94.12,24.79 94.12,26.71 C39.2 C40.2 93.85,28.22 C45.2 90.93,30.39 v91.69,31.16 | v112.01,99.99 111.89,99.86 TP16.1 | C48.2 88.38,39.02 90.55,41.19 v90.55,42.33 | C49.2 94.63,39.02 93.22,40.43 v93.22,42.33 | v98.04,31.16 C38.2 | C31.2 C32.2 | C32.2 104.63,73.7 v105.03,73.7 | C3.2 103.74,81.82 C31.2 | R40.4 179.1,45.39 v182.88,45.39 200.83,45.39 203.05,47.6 203.05,57.54 U$31.2 189.45,61.91 R41.5 | R40.5 112.29,43.6 v107.95,43.6 | v78.23,47.06 R39.4 v12.57,47.06 R39.5 | R42.4 v8.13,65.7 | R42.5 75.82,68.24 v75.82,72.56 | R41.4 122.81,63.54 v122.81,69.51
  Top 0.508: 119.51,72.81 119.51,76.12
  Top 0.762: U10.5 83.98,79.83 D6.1 85.72,76.37 v87.38,76.37 | v122.81,69.51 119.51,72.81 | v75.82,72.56 75.55,72.83 C1.2 64.94,72.83 C25.2 59.72,72.78 59.67,72.83 C24.2
  Route15 0.254: v122.81,69.51 122.81,89.2 v112.01,99.99
  Route15 0.508: 110.24,69.51 v106.93,66.21 106.93,63.41 104.01,60.49 99.57,60.49 v98.04,62.02
  Route15 1.524: U$31.2 195.34,58.59 133.73,58.59 v122.81,69.51 110.24,69.51 94.23,69.51 v87.38,76.37 83.57,72.56 v75.82,72.56
  Bottom 0.254: R3.1 106.89,66.17 v106.93,66.21 | v98.04,62.02 98.72,62.02 R48.1 | 91.44,42.33 91.44,36.11 | 91.44,36.11 92.07,35.47 95.5,35.47 98.04,32.93 v98.04,31.16 v91.69,31.16 | v86.74,31.54 91.31,36.11 91.44,36.11 | v105.03,73.7 104.63,73.7 C32.2 | R40.4 179.1,45.39 v182.88,45.39 | R25.1 97.45,43.6 v107.95,43.6 112.29,43.6 R40.5 | R15.1 82.22,47.06 v78.23,47.06 R39.4 | v12.57,47.06 R39.5 6.35,48.23 6.35,63.92 v8.13,65.7 R42.4 | R42.5 75.82,68.24 v75.82,72.56 | R41.4 122.81,63.54 v122.81,69.51 | R41.5 189.45,61.91 U$31.2
  Bottom 0.508: R33.2 82.53,81.28 U10.5 | U$31.1 U$31.2 | v87.38,76.37 94.36,83.35 R45.1 | R14.1 R15.1 v90.55,42.33 91.44,42.33 v93.22,42.33 95.92,42.33 R25.1 | R25.1 R24.1 | R48.1 99.48,60.02 95.38,55.92 95.38,42.88 R25.1 | U11.3 83.7,28.49 v86.74,31.54
TS-UNFUSED  (via drill 0.38, 1.14)
  Top 0.254: TP15.1 122.9,99.63 126.9,95.63 v126.97,95.63
  Top 0.508: 130.96,75.73 F2.1
  Top 0.762: v138.68,75.73 130.96,75.73
  Route15 0.254: v138.68,75.73 138.68,91.35 134.41,95.63 v126.97,95.63
  Route15 0.762: R40.2 174.28,54.03 R41.1
  Route15 1.524: U$31.5 194.56,54.03 R41.1
  Bottom 0.762: v138.68,75.73 162.18,75.73 R41.1
TSMP+  (via drill 0.76)
  Top 0.254: TP18.1 132.59,103.31 165.1,70.8 165.1,43.6 173.84,34.86 v179.07,34.86
  Route2 0.508: R42.2 36.07,38.65 75.44,38.65 78.59,35.5 112.42,35.5 118.24,41.32 165.86,41.32 172.32,34.86 v179.07,34.86 U$33.3
TSMP-  (via drill 0.38, 0.76)
  Top 0.254: v125.09,105.58 123.06,105.58 121.47,103.99 TP19.1
  Route15 0.254: v130.21,55.43 128.81,54.03
  Route15 0.508: U$31.4 196,55.59 130.37,55.59 v130.21,55.43 128.81,54.03 R41.2
  Bottom 0.254: v130.21,55.43 130.17,55.43 130.17,100.5 v125.09,105.58

### Text on the board
tPlace: DCDC+ | DCDC- | TS+5V | PACK+ | TSMP- | TSMP+ | TS-F | TS-U | TS+U | PACK+F | Tractive System Board Rev1 / Designed by Cody Kaminsky 2021 | IT- | IT+ | IP- | IP- | PC_OK | 12V+ | 5V+ | 5V+ | SHDN | PC_D | PC_N | PC_OK | 12V+ | HyTech Racing 2022 TSB Rev1 / Designed by Cody Kaminsky | GND | SHDN